# EAGLE design revb (EAGLE 9.6.2)

## Sheet 1 of 2
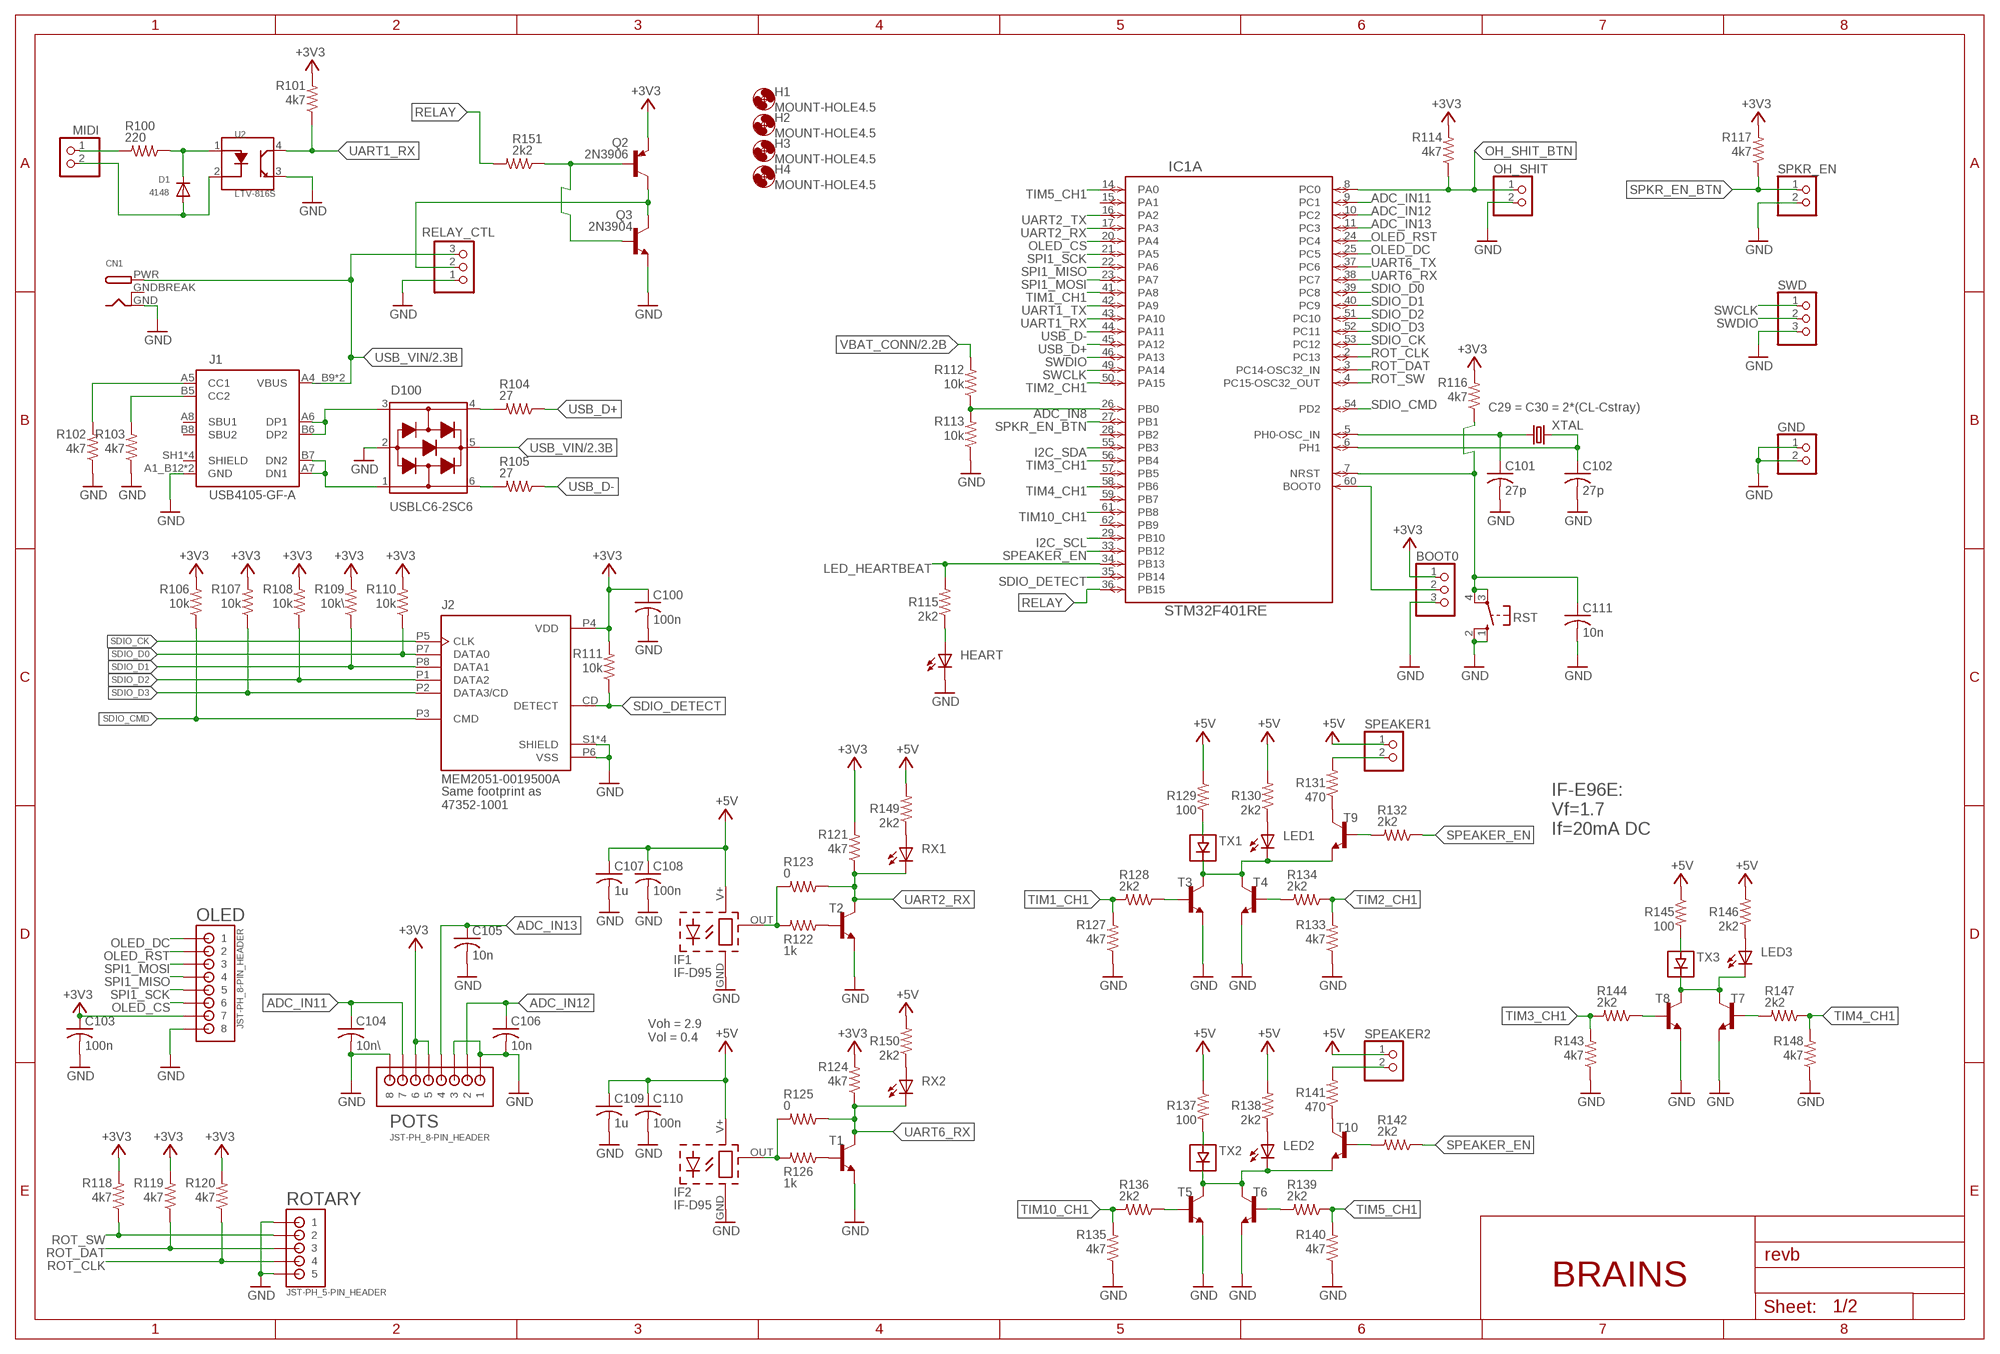
[diagram p0: schematic, sheet 1]

### Parts
BOOT0  PINHD-1X3  [1X03]
C100  100n  C-USC0603K  [C0603K]
C101  27p  C-USC0402  [C0402]
C102  27p  C-USC0402  [C0402]
C103  100n  C-USC0603K  [C0603K]
C104  10n\  C-USC0603K  [C0603K]
C105  10n  C-USC0603K  [C0603K]
C106  10n  C-USC0603K  [C0603K]
C107  1u  C-USC0603K  [C0603K]
C108  100n  C-USC0603K  [C0603K]
C109  1u  C-USC0603K  [C0603K]
C110  100n  C-USC0603K  [C0603K]
C111  10n  C-USC0603K  [C0603K]
CN1  DCBARRELPTH  [DCJACK_2MM_PTH]
D1  4148  DIODESOD-123  [SOD-123]
D100  USBLC6-2SC6  [SOT95P280X145-6N]
GND  PINHD-1X2  [1X02]
H1  MOUNT-HOLE4.5  [4,5]
H2  MOUNT-HOLE4.5  [4,5]
H3  MOUNT-HOLE4.5  [4,5]
H4  MOUNT-HOLE4.5  [4,5]
HEART  LEDCHIPLED_0805  [CHIPLED_0805]
IC1  STM32F401RE  STM32F401RET6  [LQFP64-10X10MM]
IF1  IF-D95  [IFD95]
IF2  IF-D95  [IFD95]
J1  USB4105-GF-A  [GCT_USB4105-GF-A]
J2  MEM2051-0019500A  MEM2051-00-195-00-A_REVD1MEM2051-00-195-00-A_GCT_MEM2051-00-195-00-A  [GCT_MEM2051-00-195-00-A_REVD1]
LED1  LEDCHIPLED_0805  [CHIPLED_0805]
LED2  LEDCHIPLED_0805  [CHIPLED_0805]
LED3  LEDCHIPLED_0805  [CHIPLED_0805]
MIDI  PINHD-1X2  [1X02]
OH_SHIT  PINHD-1X2  [1X02]
OLED  JST-PH_8-PIN_HEADER  [JST_B8B-PH_HEADER]
POTS  JST-PH_8-PIN_HEADER  [JST_B8B-PH_HEADER]
Q2  2N3906  [TO92]
Q3  2N3904  [TO92]
R100  220  R-US_R0603  [R0603]
R101  4k7  R-US_R0603  [R0603]
R102  4k7  R-US_R0603  [R0603]
R103  4k7  R-US_R0603  [R0603]
R104  27  R-US_R0603  [R0603]
R105  27  R-US_R0603  [R0603]
R106  10k  R-US_R0805  [R0805]
R107  10k  R-US_R0805  [R0805]
R108  10k  R-US_R0805  [R0805]
R109  10k\  R-US_R0805  [R0805]
R110  10k  R-US_R0805  [R0805]
R111  10k  R-US_R0805  [R0805]
R112  10k  R-US_R0805  [R0805]
R113  10k  R-US_R0805  [R0805]
R114  4k7  R-US_R0603  [R0603]
R115  2k2  R-US_R0603  [R0603]
R116  4k7  R-US_R0603  [R0603]
R117  4k7  R-US_R0603  [R0603]
R118  4k7  R-US_R0603  [R0603]
R119  4k7  R-US_R0603  [R0603]
R120  4k7  R-US_R0603  [R0603]
R121  4k7  R-US_R0603  [R0603]
R122  1k  R-US_R0805  [R0805]
R123  0  R-US_R0603  [R0603]
R124  4k7  R-US_R0603  [R0603]
R125  0  R-US_R0603  [R0603]
R126  1k  R-US_R0805  [R0805]
R127  4k7  R-US_R0603  [R0603]
R128  2k2  R-US_R0603  [R0603]
R129  100  R-US_R0805  [R0805]
R130  2k2  R-US_R0603  [R0603]
R131  470  R-US_R0603  [R0603]
R132  2k2  R-US_R0603  [R0603]
R133  4k7  R-US_R0603  [R0603]
R134  2k2  R-US_R0603  [R0603]
R135  4k7  R-US_R0603  [R0603]
R136  2k2  R-US_R0603  [R0603]
R137  100  R-US_R0805  [R0805]
R138  2k2  R-US_R0603  [R0603]
R139  2k2  R-US_R0603  [R0603]
R140  4k7  R-US_R0603  [R0603]
R141  470  R-US_R0603  [R0603]
R142  2k2  R-US_R0603  [R0603]
R143  4k7  R-US_R0603  [R0603]
R144  2k2  R-US_R0603  [R0603]
R145  100  R-US_R0805  [R0805]
R146  2k2  R-US_R0603  [R0603]
R147  2k2  R-US_R0603  [R0603]
R148  4k7  R-US_R0603  [R0603]
R149  2k2  R-US_R0603  [R0603]
R150  2k2  R-US_R0603  [R0603]
R151  2k2  R-US_R0603  [R0603]
RELAY_CTL  PINHD-1X3  [1X03]
ROTARY  JST-PH_5-PIN_HEADER  [JST_B5B-PH_HEADER]
RST  10-XX  [B3F-10XX]
RX1  LEDCHIPLED_0805  [CHIPLED_0805]
RX2  LEDCHIPLED_0805  [CHIPLED_0805]
SPEAKER1  PINHD-1X2  [1X02]
SPEAKER2  PINHD-1X2  [1X02]
SPKR_EN  PINHD-1X2  [1X02]
SWD  PINHD-1X3  [1X03]
T1  MMBTA06-7-F  BCV72SMD  [SOT23-BEC]
T2  MMBTA06-7-F  BCV72SMD  [SOT23-BEC]
T3  MMBTA06-7-F  BCV72SMD  [SOT23-BEC]
T4  MMBTA06-7-F  BCV72SMD  [SOT23-BEC]
T5  MMBTA06-7-F  BCV72SMD  [SOT23-BEC]
T6  MMBTA06-7-F  BCV72SMD  [SOT23-BEC]
T7  MMBTA06-7-F  BCV72SMD  [SOT23-BEC]
T8  MMBTA06-7-F  BCV72SMD  [SOT23-BEC]
T9  MMBTA06-7-F  BCV72SMD  [SOT23-BEC]
T10  MMBTA06-7-F  BCV72SMD  [SOT23-BEC]
TX1  IF-E95E  [IF-E96E]
TX2  IF-E95E  [IF-E96E]
TX3  IF-E95E  [IF-E96E]
U2  LTV-816S  SMD-PHOTOCOUPLER-5KV-LTV-816S(4P-4.6X6.5MM)  [SMD4-2.54-4.6X6.5MM]
XTAL  CRYSTALHC49S  [HC49/S]

### Nets
+3V3: BOOT0.1 C100.1 C103.1 J2.P4(VDD) OLED.P7 POTS.P5 POTS.P6 Q2.3(E) R101.2 R106.2 R107.2 R108.2 R109.2 R110.2 R111.2 R114.2 R116.2 R117.2 R118.2 R119.2 R120.2 R121.2 R124.2 ; also sheet 2
+5V: C107.1 C108.1 C109.1 C110.1 IF1.V+(VCC) IF2.V+(VCC) R129.1 R130.2 R137.1 R138.2 R145.1 R146.2 R149.2 R150.2 SPEAKER1.1 SPEAKER2.1 ; also sheet 2
ADC_IN8: IC1.26(A:PB0) R112.1 R113.2
ADC_IN11: C104.1 IC1.9(A:PC1) POTS.P7
ADC_IN12: C106.1 IC1.10(A:PC2) POTS.P2
ADC_IN13: C105.1 IC1.11(A:PC3) POTS.P4
BOOT0_CONN: BOOT0.2 IC1.60(A:BOOT0)
CC1: J1.A5(CC1) R102.2
CC2: J1.B5(CC2) R103.2
COIL1_B: R128.1 T3.B
COIL1_NEG: LED1.C T3.C T4.C T9.E TX1.GND
COIL1_POS: R129.2 TX1.SIG
COIL2_B: R136.1 T5.B
COIL2_NEG: LED2.C T5.C T6.C T10.E TX2.GND
COIL2_POS: R137.2 TX2.SIG
COIL3_B: R144.1 T8.B
COIL3_NEG: LED3.C T7.C T8.C TX3.GND
COIL3_POS: R145.2 TX3.SIG
COIL12_B: R134.2 T4.B
COIL22_B: R139.2 T6.B
COIL32_B: R147.2 T7.B
GND: BOOT0.3 C100.2 C101.2 C102.2 C103.2 C104.2 C105.2 C106.2 C107.2 C108.2 C109.2 C110.2 C111.2 CN1.GND D100.2(GND) GND.1 GND.2 HEART.C IF1.GND IF2.GND J1.A1_B12(GND) J1.B1_A12(GND) J2.P6(VSS) J2.S1(SHIELD) J2.S2(SHIELD) J2.S3(SHIELD) J2.S4(SHIELD) OH_SHIT.2 OLED.P8 POTS.P1 POTS.P3 POTS.P8 Q3.3(E) R102.1 R103.1 R113.1 R127.1 R133.1 R135.1 R140.1 R143.1 R148.1 RELAY_CTL.1 ROTARY.P1 ROTARY.P5 RST.1(S) RST.2(S1) SPKR_EN.2 SWD.3 T1.E T2.E T3.E T4.E T5.E T6.E T7.E T8.E U2.3(EMITER) ; also sheet 2
I2C_SCL: IC1.29(A:PB10) ; also sheet 2
I2C_SDA: IC1.55(A:PB3) ; also sheet 2
IF1-OUT: IF1.OUT R122.2 R123.2
IF2-OUT: IF2.OUT R125.2 R126.2
LED_HEARTBEAT: IC1.34(A:PB13) R115.2
LTV+: D1.C R100.1 U2.1(ANODE)
LTV-: D1.A MIDI.2 U2.2(CATHODE)
MID_RX_IN: MIDI.1 R100.2
N$2: LED1.A R130.1
N$3: R122.1 T2.B
N$4: LED3.A R146.1
N$5: LED2.A R138.1
N$7: R149.1 RX1.A
N$8: R150.1 RX2.A
N$9: R126.1 T1.B
N$10: R131.1 T9.C
N$21: R141.1 T10.C
NRST: C111.1 IC1.7(A:NRST) R116.1 RST.3(P) RST.4(P1)
OH_SHIT_BTN: IC1.8(A:PC0) OH_SHIT.1 R114.1
OLED_CS: IC1.20(A:PA4) OLED.P6
OLED_DC: IC1.25(A:PC5) OLED.P1
OLED_RST: IC1.24(A:PC4) OLED.P2
R-HB: HEART.A R115.1
RELAY: IC1.36(A:PB15) R151.2
RELAY_OUT: Q2.1(C) Q3.1(C) RELAY_CTL.2
RLY_BASE: Q2.2(B) Q3.2(B) R151.1
ROT_CLK: IC1.2(A:PC13) R120.1 ROTARY.P4
ROT_DAT: IC1.3(A:PC14-OSC32_IN) R119.1 ROTARY.P3
ROT_SW: IC1.4(A:PC15-OSC32_OUT) R118.1 ROTARY.P2
SDIO_CK: IC1.53(A:PC12) J2.P5(CLK)
SDIO_CMD: IC1.54(A:PD2) J2.P3(CMD) R106.1
SDIO_D0: IC1.39(A:PC8) J2.P7(DATA0) R110.1
SDIO_D1: IC1.40(A:PC9) J2.P8(DATA1) R109.1
SDIO_D2: IC1.51(A:PC10) J2.P1(DATA2) R108.1
SDIO_D3: IC1.52(A:PC11) J2.P2(DATA3/CD) R107.1
SDIO_DETECT: IC1.35(A:PB14) J2.CD(DETECT) R111.1
SPEAK1-R: R131.2 SPEAKER1.2
SPEAKER_EN: IC1.33(A:PB12) R132.1 R142.1
SPI1_MISO: IC1.22(A:PA6) OLED.P4
SPI1_MOSI: IC1.23(A:PA7) OLED.P3
SPI1_SCK: IC1.21(A:PA5) OLED.P5
SPK2_R: R141.2 SPEAKER2.2
SPK_EN1_B: R132.2 T9.B
SPK_EN2_B: R142.2 T10.B
SPKR_EN_BTN: IC1.27(A:PB1) R117.1 SPKR_EN.1
SWCLK: IC1.49(A:PA14) SWD.1
SWDIO: IC1.46(A:PA13) SWD.2
TIM1_CH1: IC1.41(A:PA8) R127.2 R128.2
TIM2_CH1: IC1.50(A:PA15) R133.2 R134.1
TIM3_CH1: IC1.56(A:PB4) R143.2 R144.2
TIM4_CH1: IC1.58(A:PB6) R147.1 R148.2
TIM5_CH1: IC1.14(A:PA0) R139.1 R140.2
TIM10_CH1: IC1.61(A:PB8) R135.2 R136.2
UART1_RX: IC1.43(A:PA10) R101.1 U2.4(COLLECTOR)
UART1_TX: IC1.42(A:PA9)
UART2_RX: IC1.17(A:PA3) R121.1 R123.1 RX1.C T2.C
UART2_TX: IC1.16(A:PA2)
UART6_RX: IC1.38(A:PC7) R124.1 R125.1 RX2.C T1.C
UART6_TX: IC1.37(A:PC6)
USB_D+: IC1.45(A:PA12) R104.1
USB_D-: IC1.44(A:PA11) R105.1
USB_VIN: CN1.PWR D100.5(VBUS) J1.A4_B9(VBUS) J1.B4_A9(VBUS) RELAY_CTL.3 ; also sheet 2
USBDN_CONN: D100.1(I/O1_IN) J1.A7(DN1) J1.B7(DN2)
USBDP_CONN: D100.3(I/O2_IN) J1.A6(DP1) J1.B6(DP2)
USBRESD_N: D100.6(I/O1_OUT) R105.2
USBRESD_P: D100.4(I/O2_OUT) R104.2
VBAT_CONN: R112.2 ; also sheet 2
XTAL1: C101.1 IC1.5(A:PH0-OSC_IN) XTAL.1
XTAL2: C102.1 IC1.6(A:PH1) XTAL.2
Unconnected: IC1.15(A:PA1) IC1.28(A:PB2) IC1.57(A:PB5) IC1.59(A:PB7) IC1.62(A:PB9) J1.A8(SBU1) J1.B8(SBU2)

### Notes on the sheet
- C29 = C30 = 2*(CL-Cstray)
- Same footprint as 
  47352-1001
- IF-E96E:
  Vf=1.7
  If=20mA DC
- Voh = 2.9
  Vol = 0.4
- BRAINS

## Sheet 2 of 2
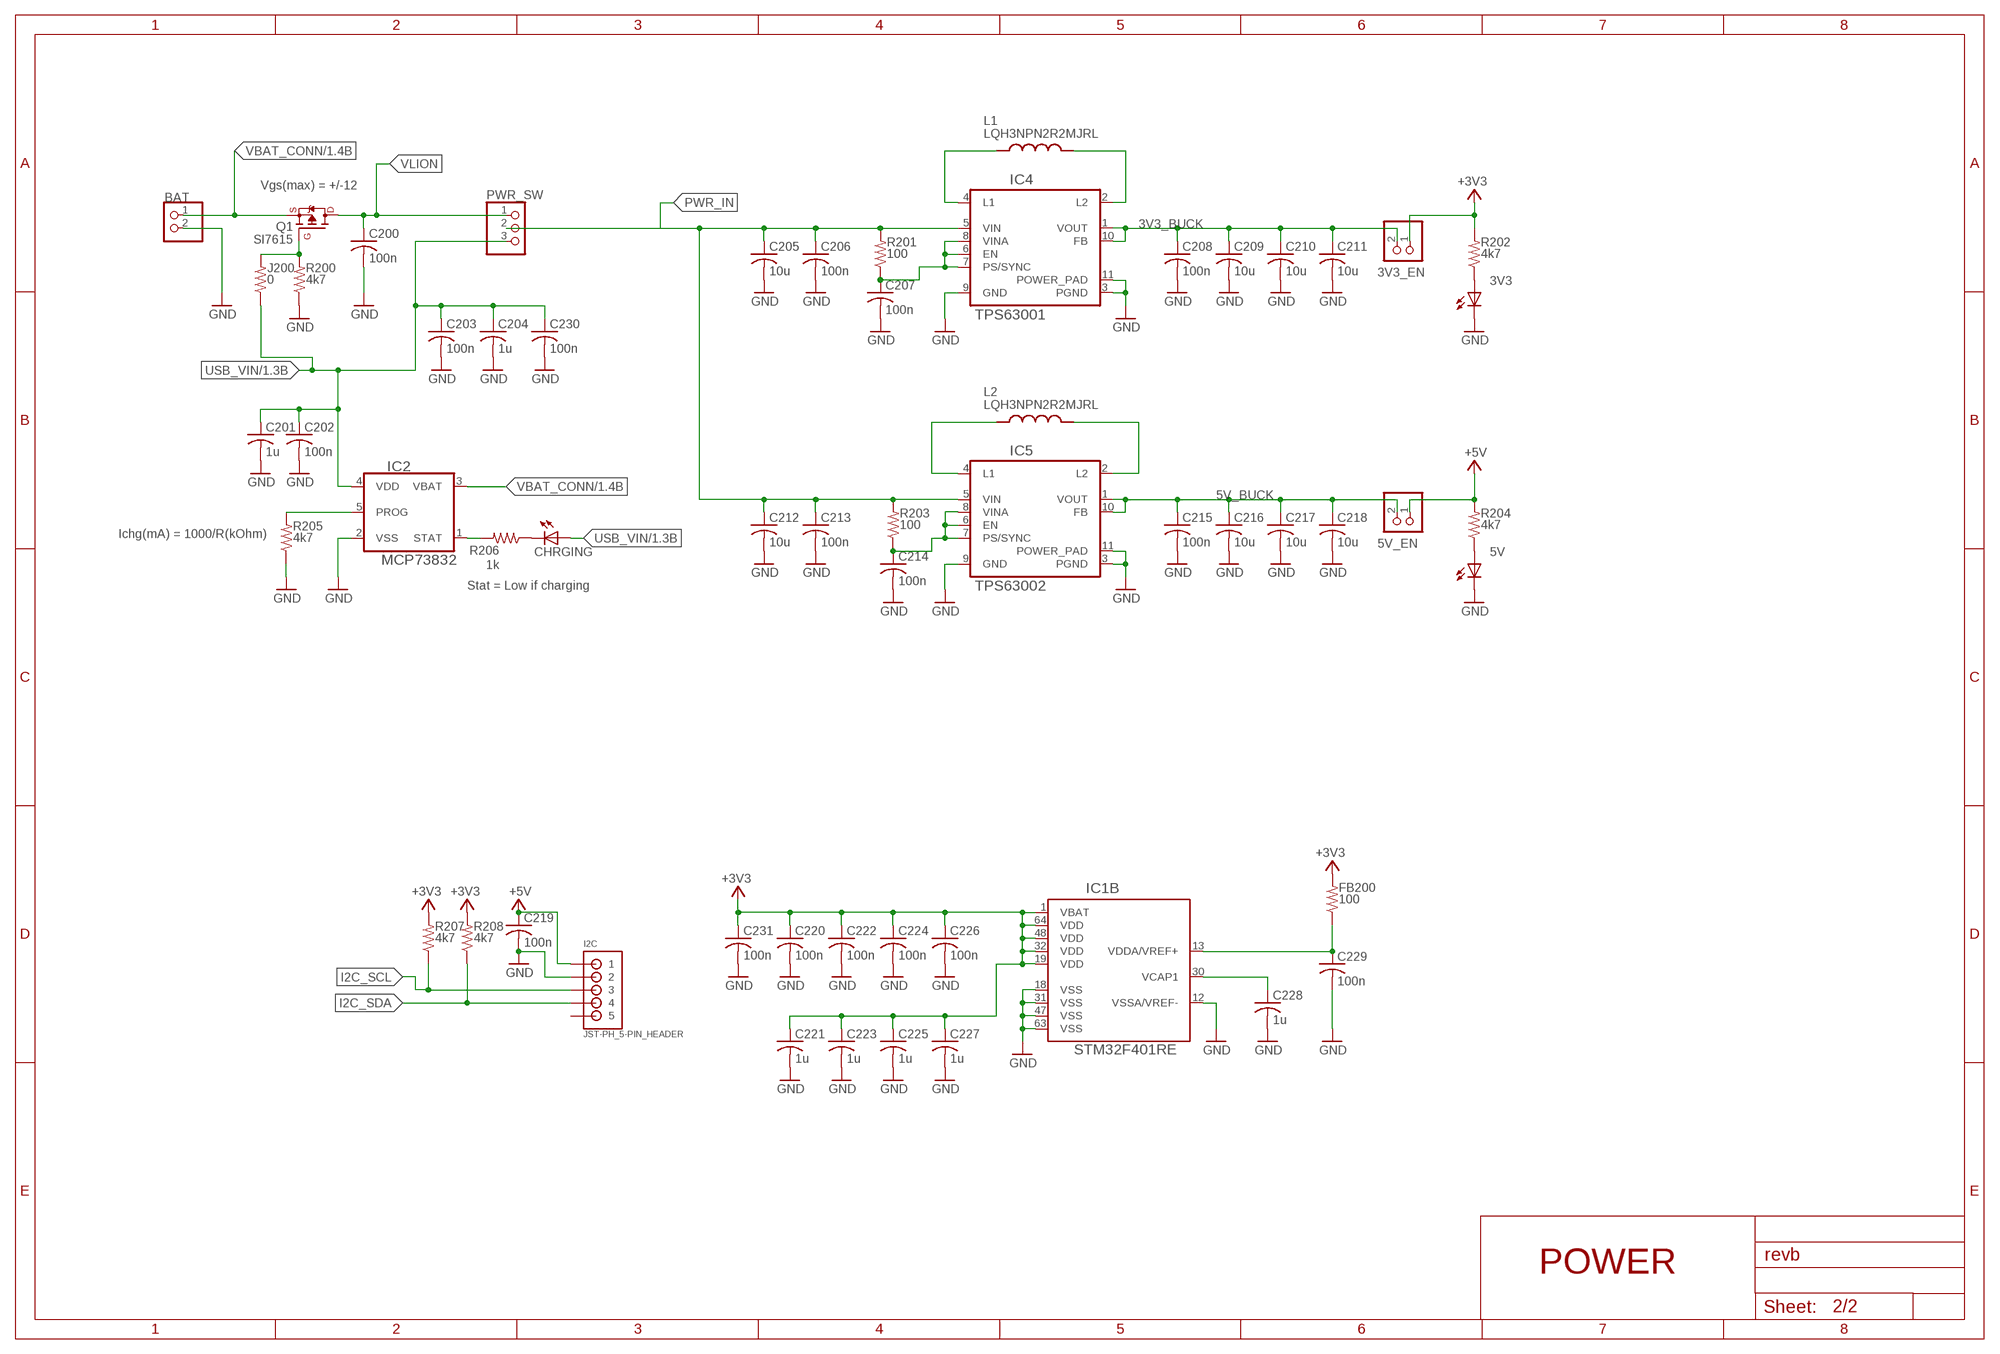
[diagram p1: schematic, sheet 2]

### Parts
3V3  LEDCHIPLED_0603  [CHIPLED_0603]
3V3_EN  PINHD-1X2  [1X02]
5V  LEDCHIPLED_0603  [CHIPLED_0603]
5V_EN  PINHD-1X2  [1X02]
BAT  JST_2PIN-THM  [JST-PH-2-THM]
C200  100n  C-USC0603K  [C0603K]
C201  1u  C-USC0603K  [C0603K]
C202  100n  C-USC0603K  [C0603K]
C203  100n  C-USC0603K  [C0603K]
C204  1u  C-USC0603K  [C0603K]
C205  10u  C-USC0805  [C0805]
C206  100n  C-USC0603K  [C0603K]
C207  100n  C-USC0603K  [C0603K]
C208  100n  C-USC0603K  [C0603K]
C209  10u  C-USC0805  [C0805]
C210  10u  C-USC0805  [C0805]
C211  10u  C-USC0805  [C0805]
C212  10u  C-USC0805  [C0805]
C213  100n  C-USC0603K  [C0603K]
C214  100n  C-USC0603K  [C0603K]
C215  100n  C-USC0603K  [C0603K]
C216  10u  C-USC0805  [C0805]
C217  10u  C-USC0805  [C0805]
C218  10u  C-USC0805  [C0805]
C219  100n  C-USC0603K  [C0603K]
C220  100n  C-USC0603K  [C0603K]
C221  1u  C-USC0603K  [C0603K]
C222  100n  C-USC0603K  [C0603K]
C223  1u  C-USC0603K  [C0603K]
C224  100n  C-USC0603K  [C0603K]
C225  1u  C-USC0603K  [C0603K]
C226  100n  C-USC0603K  [C0603K]
C227  1u  C-USC0603K  [C0603K]
C228  1u  C-USC0603K  [C0603K]
C229  100n  C-USC0603K  [C0603K]
C230  100n  C-USC0603K  [C0603K]
C231  100n  C-USC0603K  [C0603K]
CHRGING  LEDCHIPLED_1206  [CHIPLED_1206]
FB200  100  R-US_R0603  [R0603]
I2C  JST-PH_5-PIN_HEADER  [JST_B5B-PH_HEADER]
IC2  MCP73832  MCP73831T-2ACI/OT  [SOT95P280X145-5N]
IC4  TPS63001  TPS63001DRCR  [VREG_V62/16624-01YE]
IC5  TPS63002  TPS63001DRCR  [VREG_V62/16624-01YE]
J200  0  R-US_R0402  [R0402]
L1  LQH3NPN2R2MJRL  [IND_LQH3NPN2R2MJRL]
L2  LQH3NPN2R2MJRL  [IND_LQH3NPN2R2MJRL]
PWR_SW  PINHD-1X3  [1X03]
Q1  SI7615  SI7611DN-T1-GE3  [VISHAY_SIS468DN-T1-GE3]
R200  4k7  R-US_R0603  [R0603]
R201  100  R-US_R0603  [R0603]
R202  4k7  R-US_R0603  [R0603]
R203  100  R-US_R0603  [R0603]
R204  4k7  R-US_R0603  [R0603]
R205  4k7  R-US_R0603  [R0603]
R206  1k  R-US_R0603  [R0603]
R207  4k7  R-US_R0603  [R0603]
R208  4k7  R-US_R0603  [R0603]

### Nets
3V3_BUCK: 3V3_EN.2 C208.1 C209.1 C210.1 C211.1 IC4.1(VOUT) IC4.10(FB)
5V_BUCK: 5V_EN.2 C215.1 C216.1 C217.1 C218.1 IC5.1(VOUT) IC5.10(FB)
+3V3: 3V3_EN.1 C220.1 C221.1 C222.1 C223.1 C224.1 C225.1 C226.1 C227.1 C231.1 FB200.2 IC1.1(B:VBAT) IC1.19(B:VDD) IC1.32(B:VDD) IC1.48(B:VDD) IC1.64(B:VDD) R202.2 R207.2 R208.2 ; also sheet 1
+5V: 5V_EN.1 C219.1 I2C.P1 R204.2 ; also sheet 1
BUCK33_LOGIC: C207.1 IC4.6(EN) IC4.7(PS/SYNC) IC4.8(VINA) R201.1
BUCK50_LOGIC: C214.1 IC5.6(EN) IC5.7(PS/SYNC) IC5.8(VINA) R203.1
CHG_PROG: IC2.5(PROG) R205.2
CHRG_STAT: IC2.1(STAT) R206.2
GND: 3V3.C 5V.C BAT.2 C200.2 C201.2 C202.2 C203.2 C204.2 C205.2 C206.2 C207.2 C208.2 C209.2 C210.2 C211.2 C212.2 C213.2 C214.2 C215.2 C216.2 C217.2 C218.2 C219.2 C220.2 C221.2 C222.2 C223.2 C224.2 C225.2 C226.2 C227.2 C228.2 C229.2 C230.2 C231.2 I2C.P2 IC1.12(B:VSSA/VREF-) IC1.18(B:VSS) IC1.31(B:VSS) IC1.47(B:VSS) IC1.63(B:VSS) IC2.2(VSS) IC4.3(PGND) IC4.9(GND) IC4.11(POWER_PAD) IC5.3(PGND) IC5.9(GND) IC5.11(POWER_PAD) R200.1 R205.1 ; also sheet 1
I2C_SCL: I2C.P3 R207.1 ; also sheet 1
I2C_SDA: I2C.P4 R208.1 ; also sheet 1
IC4L1: IC4.4(L1) L1.1
IC4L2: IC4.2(L2) L1.2
IC5L1: IC5.4(L1) L2.1
IC5L2: IC5.2(L2) L2.2
N$1: 3V3.A R202.1
N$6: 5V.A R204.1
N$17: CHRGING.C R206.1
PMOS_G: J200.2 Q1.4(G) R200.2
PWR_IN: C205.1 C206.1 C212.1 C213.1 IC4.5(VIN) IC5.5(VIN) PWR_SW.2 R201.2 R203.2
USB_VIN: C201.1 C202.1 C203.1 C204.1 C230.1 CHRGING.A IC2.4(VDD) J200.1 PWR_SW.3 ; also sheet 1
VBAT_CONN: BAT.1 IC2.3(VBAT) Q1.1(S) Q1.2(S) Q1.3(S) ; also sheet 1
VCAP1: C228.1 IC1.30(B:VCAP1)
VLION: C200.1 PWR_SW.1 Q1.5(D) Q1.6(D) Q1.7(D) Q1.8(D) Q1.9(D)
VREF+: C229.1 FB200.1 IC1.13(B:VDDA/VREF+)
Unconnected: I2C.P5

### Notes on the sheet
- Vgs(max) = +/-12
- Ichg(mA) = 1000/R(kOhm)
- Stat = Low if charging
- POWER

## Power pins joined to a net without a drawn wire
GNDBREAK: CN1.GNDBREAK
SHIELD: J1.SH1(SHIELD) J1.SH2(SHIELD) J1.SH3(SHIELD) J1.SH4(SHIELD)

## Library data of the parts
3V3 5V CHRGING HEART LED1-LED3 RX1 RX2 = adafruit:LED: LED OSRAM: - CHIPLED LG R971, LG N971, LY N971, LG Q971, LY Q971, LO R971, LY R971 LH N974, LH R974 LS Q976, LO Q976, LY Q976 LO Q996 - Hyper CHIPLED LW Q18S LB Q993, LB Q99A, LB R99A - SideLED LS A670, LO A670, LY A670, LG A670, LP A670 LB A673, LV A673, LT A673, LW A673 LH A674 LY A675 LS A676, LA A676, LO A676, LY A676, LW A676 LS A679, LY A679, LG A679 - Hyper Micro SIDELED® LS Y876, LA Y876, LO Y876, LY Y876 LT Y87S - SmartLED LW L88C, LW L88S LB L89C, LB L89S, LG L890 LS L89K, LO L89K, LY L89K LS L896, LA L896, LO L896, LY L896 - TOPLED LS T670, LO T670, LY T670, LG T670, LP T670 LSG T670, LSP T670, LSY T670, LOP T670, LYG T670 LG T671, LOG T671, LSG T671 LB T673, LV T673, LT T673, LW T673 LH T674 LS T676, LA T676, LO T676, LY T676, LB T676, LH T676, LSB T676, LW T676 LB T67C, LV T67C, LT T67C, LS T67K, LO T67K, LY T67K, LW E67C LS E67B, LA E67B, LO E67B, LY E67B, LB E67C, LV E67C, LT E67C LW T67C LS T679, LY T679, LG T679 LS T770, LO T770, LY T770, LG T770, LP T770 LB T773, LV T773, LT T773, LW T773 LH T774 LS E675, LA E675, LY E675, LS T675 LS T776, LA T776, LO T776, LY T776, LB T776 LHGB T686 LT T68C, LB T68C - Hyper Mini TOPLED® LB M676 - Mini TOPLED Santana® LG M470 LS M47K, LO M47K, LY M47K Source: http://www.osram.convergy.de/
3V3_EN 5V_EN GND MIDI OH_SHIT SPEAKER1 SPEAKER2 SPKR_EN = pinhead:PINHD-1X2: PIN HEADER
BAT = adafruit:JST_2PIN: JST 2-Pin Connectors of various flavors SMT-RA (S2B-PH-SM4) 4UConnector #17311 SMT (B2B-PH-SM4) THM-RA (S2B-PH) THM (B2B-PH)
BOOT0 = pinhead:PINHD-1X3: PIN HEADER
C100-C111 C200-C231 = adafruit:C-US: CAPACITOR, American symbol
CN1 = adafruit:DCBARREL: 2.0mm DC Barrel Jack DCJACK_2MM_PTH - Through Hole Jack (4UConnector: 05537)
D1 = adafruit:DIODE: Diode SMADIODE - SMA Surface Mount Package 20V 1A Schottky Diode Digikey: 641-1014-6-ND DO-1N4148 - Through Hole Small Current Diode SOD-123 20V 1 A (.5mV Vf) Schottky Diode - Digikey: MBRX120TPMSCT-ND SOD-323 10V 570mA (.38mV Vf, 3ns) Schottky Diode - Digikey: ZLLS410CT-ND SOD-523 30V 30mA Schottky Diode (RB751S-40TE61) - Digikey: RB751S-40TE61CT-ND SOT23-R/W - SOT23 Package (R = Solder Paste/Reflow Ovens, W = Hand-Soldering) BAT54Film 40V 300mA - Digikey: 497-7162-1-ND
D100 = USBLC6-2SC6:USBLC6-2SC6: Check availability <https://pricing.snapeda.com/parts/USBLC6-2SC6/STMicroelectronics/view-part?ref=eda> Check availability <https://pricing.snapeda.com/parts/USBLC6-2SC6/STMicroelectronics/view-part?ref=eda>; AVAILABILITY: In Stock; DESCRIPTION: 17V Clamp 5A (8/20µs) Ipp Tvs Diode Surface Mount SOT-23-6; MF: STMicroelectronics; MP: USBLC6-2SC6; PACKAGE: SOT-23-6 STMicroelectronics; PRICE: None; PURCHASE-URL: https://pricing.snapeda.com/search/part/USBLC6-2SC6/?ref=eda
FB200 J200 R100-R151 R200-R208 = rcl:R-US_: RESISTOR, American symbol; SPICEPREFIX: R
H1-H4 = holes:MOUNT-HOLE: MOUNTING HOLE with drill center marker
I2C ROTARY = SRG:JST-PH_5-PIN_HEADER: 5-pin JST PH Shrouded Header, top entry P/N B5B-PH-K-S Mating connector PHR-5 Mating cable assembly: Sparkfun PRT-09917 <http://www.sparkfun.com/products/9917>
IC1 = F401RE_interrupter:STM32F401RET6; COPYRIGHT: Copyright (C) 2024 Ultra Librarian. All rights reserved.; MANUFACTURER_PART_NUMBER: STM32F401RET6; MFR_NAME: STMicroelectronics
IC2 = MCP73831T-2ACI_OT:MCP73831T-2ACI/OT: Charge Management Controller; MPN: MCP73831T-2ACI/OT; OC_FARNELL: 1332158; OC_NEWARK: 56K7045; PACKAGE: SOT-5; SUPPLIER: Microchip
IC4 IC5 = TPS63001DRCR:TPS63001DRCR
IF1 IF2 = onecoil:IF-D95
J1 = USB4105-GF-A:USB4105-GF-A; MANUFACTURER: Global Connector Technology; MAXIMUM_PACKAGE_HEIGHT: 3.31mm; PARTREV: B3; STANDARD: Manufacturer Recommendations
J2 = MEM2051-00-195-00-A_REVD1:MEM2051-00-195-00-A_REVD1; MANUFACTURER: GCT; MAXIMUM_PACKAGE_HEIGHT: 2.05 mm; PARTREV: D1; SNAPEDA_PN: MEM2051-00-195-00-A; STANDARD: Manufacturer Recommendations
L1 L2 = LQH3NPN2R2MJRL:LQH3NPN2R2MJRL: Inductor Power Chip Shielded Wirewound 33uH 20% 1MHz Ferrite 0.63A 0.948Ohm DCR 1212 T/R; MANUFACTURER: Murata; MAXIMUM_PACKAGE_HEIGHT: 1.2mm; PARTREV: N/A; STANDARD: Manufacturer Recommendations
OLED POTS = SRG:JST-PH_8-PIN_HEADER
PWR_SW RELAY_CTL SWD = adafruit:PINHD-1X3: PIN HEADER
Q1 = SI7611DN-T1-GE3:SI7611DN-T1-GE3: P-Channel 40 V 0.025 Ohm 39 W Surface Mount Power Mosfet - PowerPAK-1212-8 Check availability <https://pricing.snapeda.com/parts/SI7611DN-T1-GE3/Vishay/view-part?ref=eda>; AVAILABILITY: In Stock; CHECK_PRICES: https://www.snapeda.com/parts/SI7611DN-T1-GE3/Vishay+Siliconix/view-part/?ref=eda; DESCRIPTION: MOSFET P-CH 40V 18A 1212-8 | Siliconix / Vishay SI7611DN-T1-GE3; MF: Vishay; MP: SI7611DN-T1-GE3; PACKAGE: PowerPAK®-1212 Vishay; PRICE: None; PURCHASE-URL: https://www.snapeda.com/api/url_track_click_mouser/?unipart_id=245086&manufacturer=Vishay&part_name=SI7611DN-T1-GE3&search_term=None; SNAPEDA_LINK: https://www.snapeda.com/parts/SI7611DN-T1-GE3/Vishay+Siliconix/view-part/?ref=snap
Q2 = transistor-pnp:2N3906: PNP Transistor
Q3 = transistor-neu-to92:2N3904: NPN TRANSISTOR
RST = switch-omron:10-XX: OMRON SWITCH; MPN: B3F-1000; OC_FARNELL: 176432; OC_NEWARK: 36M3542
T1-T10 = transistor-npn:BCV72*: NPN Transistor
TX1-TX3 = IF-E96E:IF-E95E
U2 = LTV-816S:SMD-PHOTOCOUPLER-5KV-LTV-816S(4P-4.6X6.5MM): 306060007; MPN: LTV-816S
XTAL = adafruit:CRYSTAL: CRYSTAL; OC_FARNELL: 1667008; OC_NEWARK: unknown

## Board
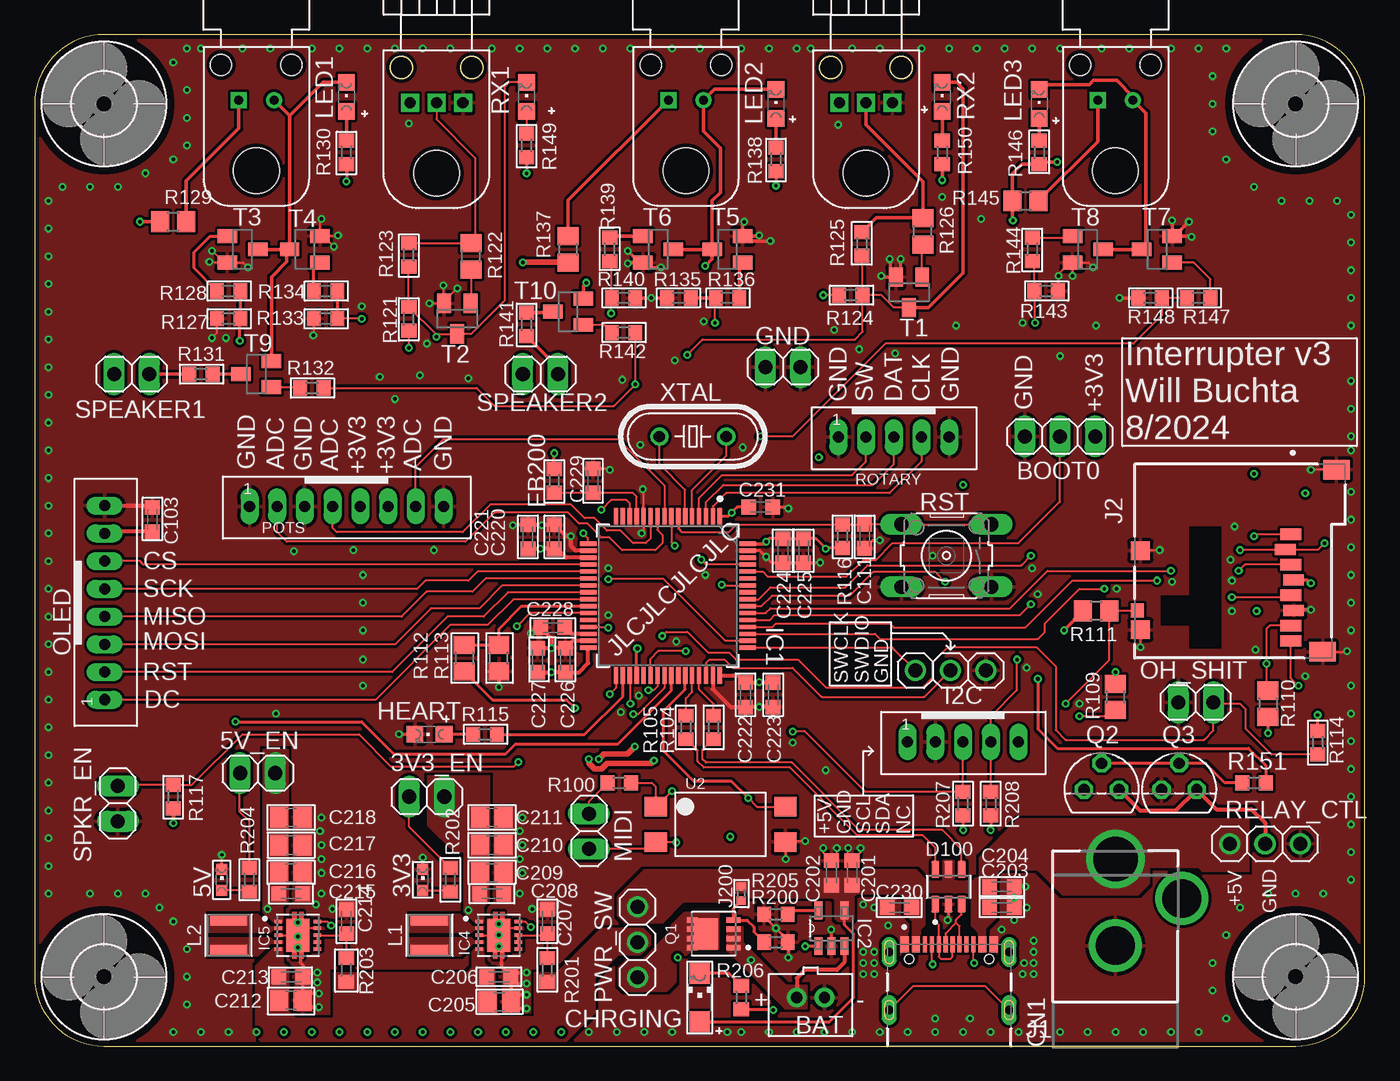
[diagram p2: board, top side]
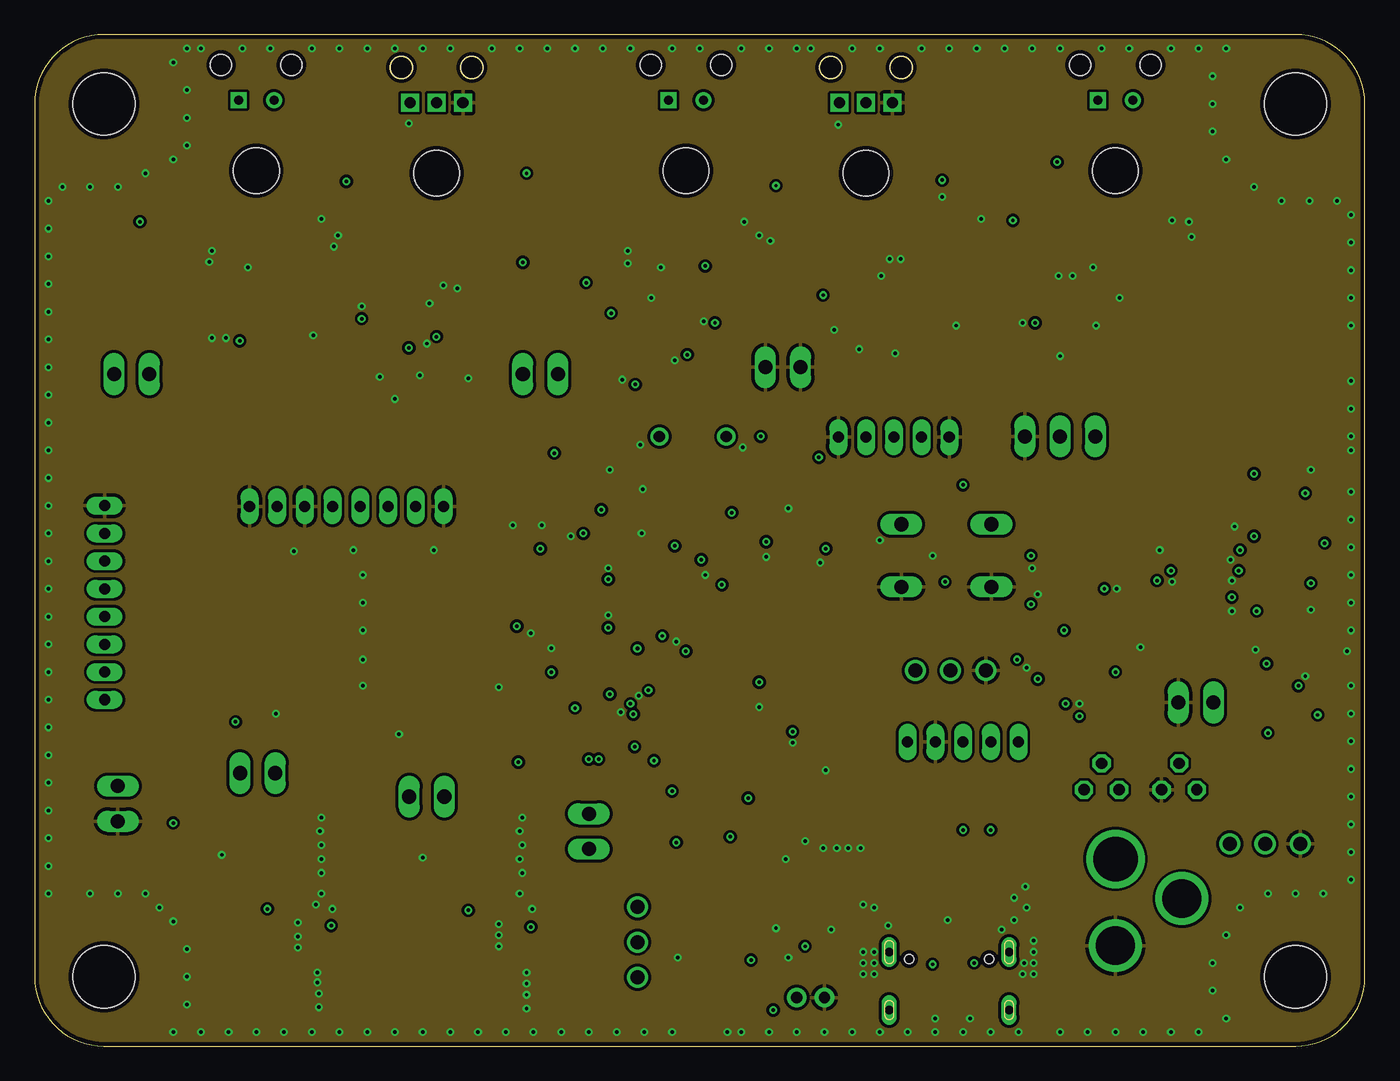
[diagram p3: board, inner layer Route2]
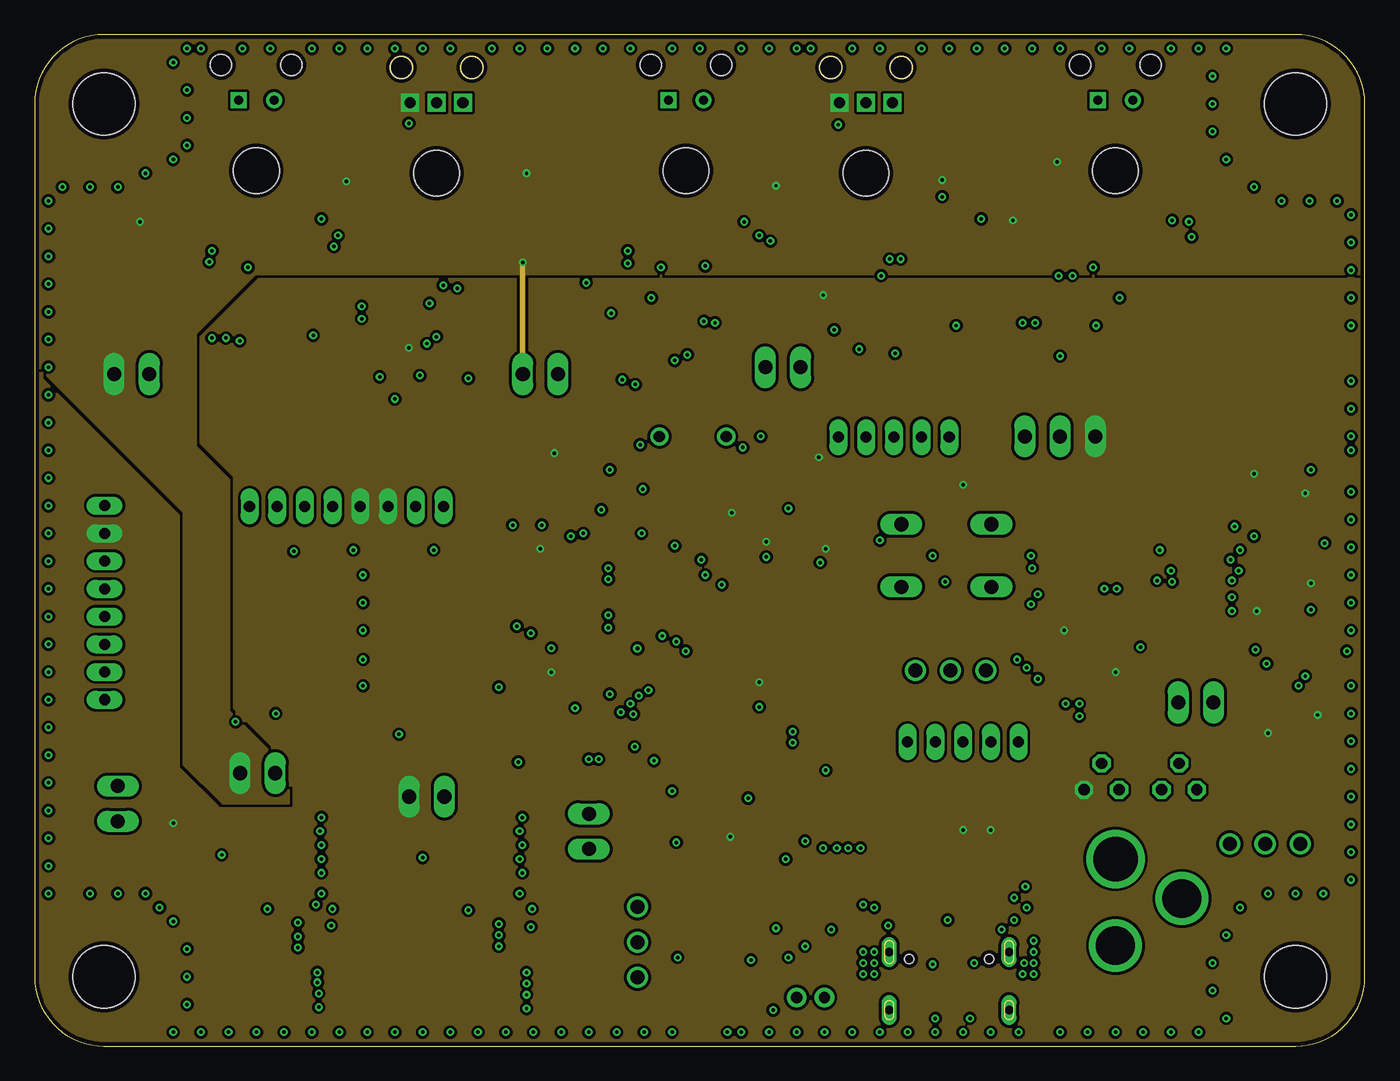
[diagram p4: board, inner layer Route15]
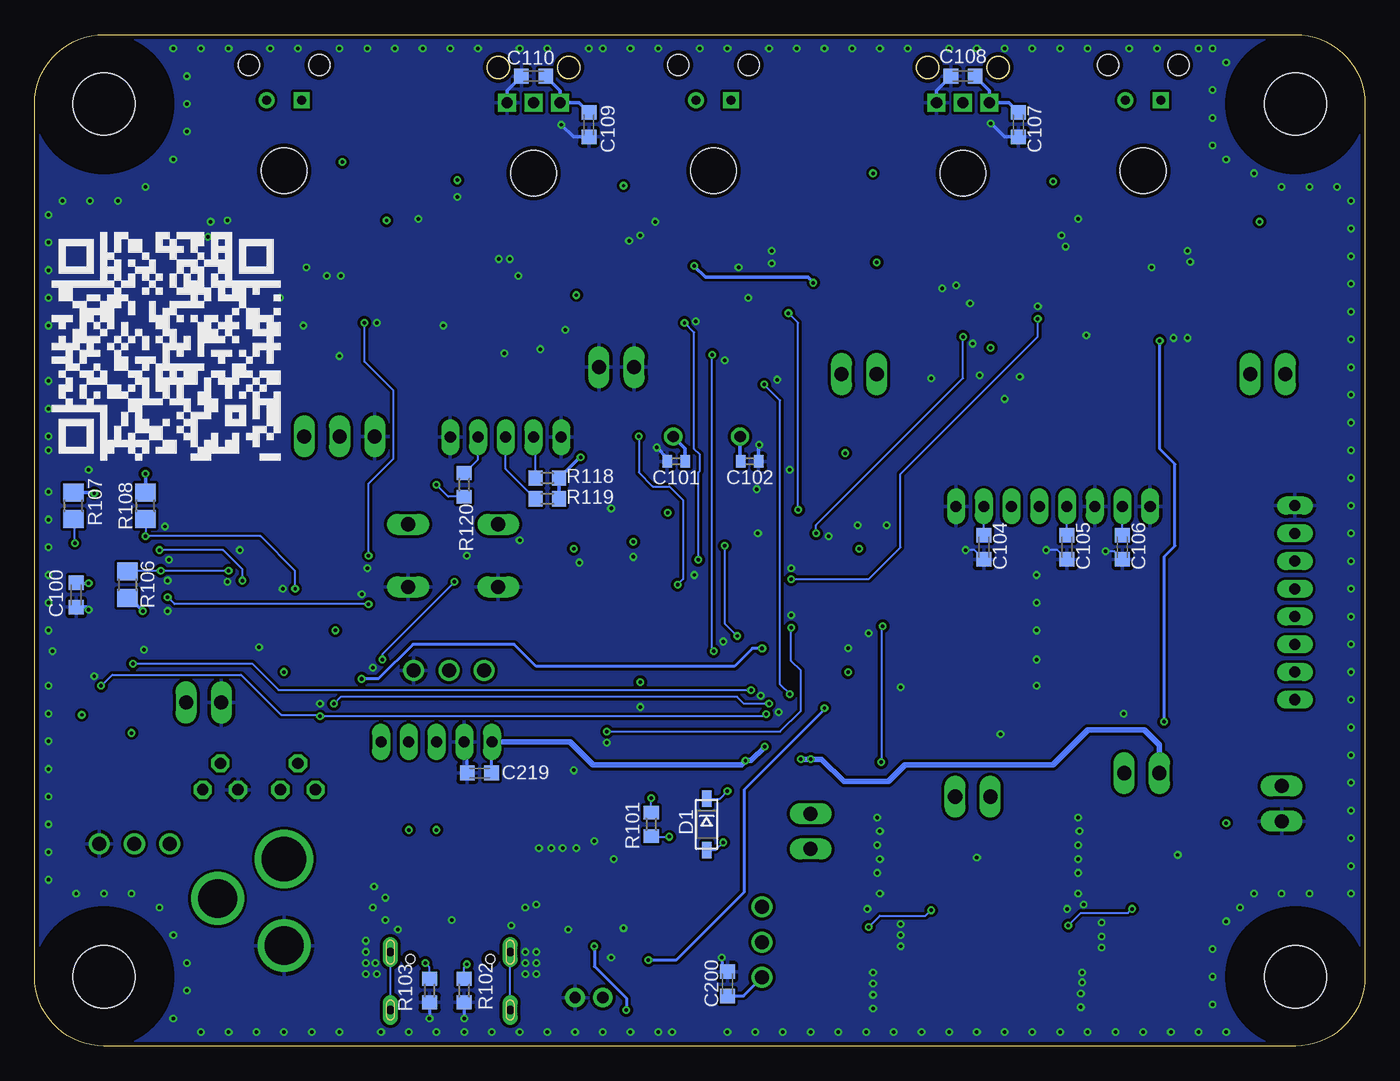
[diagram p5: board, bottom side, seen from below]

Size 96 x 73 mm. Coordinates in mm from the lower left corner, seen from the top.
Outline: 0,68 0,5 arc90 5,0 91,0 arc90 96,5 96,68 arc90 91,73 5,73 arc90 0,68
Copper layers (1+2*15+16): Top 0.035mm / dielectric 0.15mm / Route2 0.035mm / dielectric 0.15mm / Route15 0.035mm / dielectric 0.2mm / Bottom 0.035mm
Design rules "jlc-4 *": minimum track width 6mil, minimum drill 0.2mm, track to track 8mil, track to pad 7mil, pad to pad 7mil, via to via 8mil, smd to smd 6mil, copper to edge 0.3mm, drill to drill 0.4mm, minimum pad ring 0.25mm, minimum via ring 0.15mm, stop-mask expansion 4mil, vias tented up to drill 0mil, thermal gap 10mil

### Footprints (pad centres in the part's own frame; a part is rotated, then mirrored left to right if it is on the bottom)
CHIPLED_0603 = smd 0.8 x 0.8: A 0,-0.75; C 0,0.75
1X02 = drill 1.016 long: 1 -1.27,0; 2 1.27,0
JST-PH-2-THM = drill 0.8 pad 1.422: 1 1,0; 2 -1,0
1X03 = drill 1.016 long: 1 -2.54,0; 2 0,0; 3 2.54,0
C0603K = smd 1.05 x 1.08: 1 -0.875,0; 2 0.875,0
C0402 = smd 0.7 x 0.9: 1 -0.65,0; 2 0.65,0
C0805 = smd 1.3 x 1.5: 1 -0.85,0; 2 0.85,0
CHIPLED_1206 = smd 1.5 x 1.5: A 0,-1.75; C 0,1.75
DCJACK_2MM_PTH = drill 2.8: GND 0,7.35; GNDBREAK 4.8,10.75 | drill 3.2: PWR 0,13.6
SOD-123 = smd 1.2 x 0.7: A 1.85,0; C -1.85,0
SOT95P280X145-6N = smd 1.21 x 0.59: 1 -1.255,0.95; 2 -1.255,0; 3 -1.255,-0.95; 4 1.255,-0.95; 5 1.255,0; 6 1.255,0.95
R0603 = smd 1 x 1.1: 1 -0.85,0; 2 0.85,0
4,5 = hole 4.5: 0,0
CHIPLED_0805 = smd 1.2 x 1.2: A 0,-1.05; C 0,1.05
JST_B5B-PH_HEADER = drill 0.8 long: P1 4,0.048; P2 2,0.048; P3 0,0.048; P4 -2,0.048; P5 -4,0.048
LQFP64-10X10MM = smd 1.194 x 0.305: 1 -5.75,3.75; 2 -5.75,3.25; 3 -5.75,2.75; 4 -5.75,2.25; 5 -5.75,1.75; 6 -5.75,1.25; 7 -5.75,0.75; 8 -5.75,0.25; 9 -5.75,-0.25; 10 -5.75,-0.75; 11 -5.75,-1.25; 12 -5.75,-1.75; 13 -5.75,-2.25; 14 -5.75,-2.75; 15 -5.75,-3.25; 16 -5.75,-3.75; 33 5.75,-3.75; 34 5.75,-3.25; 35 5.75,-2.75; 36 5.75,-2.25; 37 5.75,-1.75; 38 5.75,-1.25; 39 5.75,-0.75; 40 5.75,-0.25; 41 5.75,0.25; 42 5.75,0.75; 43 5.75,1.25; 44 5.75,1.75; 45 5.75,2.25; 46 5.75,2.75; 47 5.75,3.25; 48 5.75,3.75 | smd 0.305 x 1.194: 17 -3.75,-5.75; 18 -3.25,-5.75; 19 -2.75,-5.75; 20 -2.25,-5.75; 21 -1.75,-5.75; 22 -1.25,-5.75; 23 -0.75,-5.75; 24 -0.25,-5.75; 25 0.25,-5.75; 26 0.75,-5.75; 27 1.25,-5.75; 28 1.75,-5.75; 29 2.25,-5.75; 30 2.75,-5.75; 31 3.25,-5.75; 32 3.75,-5.75; 49 3.75,5.75; 50 3.25,5.75; 51 2.75,5.75; 52 2.25,5.75; 53 1.75,5.75; 54 1.25,5.75; 55 0.75,5.75; 56 0.25,5.75; 57 -0.25,5.75; 58 -0.75,5.75; 59 -1.25,5.75; 60 -1.75,5.75; 61 -2.25,5.75; 62 -2.75,5.75; 63 -3.25,5.75; 64 -3.75,5.75
SOT95P280X145-5N = smd 1.27 x 0.559: 1 -1.295,0.94; 2 -1.295,0; 3 -1.295,-0.94; 4 1.295,-0.94; 5 1.295,0.94
VREG_V62/16624-01YE = smd 0.6 x 0.24: 1 -1.4,1; 2 -1.4,0.5; 3 -1.4,0; 4 -1.4,-0.5; 5 -1.4,-1; 6 1.4,-1; 7 1.4,-0.5; 8 1.4,0; 9 1.4,0.5; 10 1.4,1 | smd 1.65 x 2.4: 11 0,0
IFD95 = drill 0.8 square: GND 1.905,5.08; OUT 0,5.08; V+ -1.905,5.08 | hole 1.6: -2.54,7.62; 2.54,7.62 | hole 3.3: 0,0
GCT_USB4105-GF-A = smd 0.6 x 1.15: A1_B12 -3.2,4.755; A4_B9 -2.4,4.755; B1_A12 3.2,4.755; B4_A9 2.4,4.755 | smd 0.3 x 1.15: A5 -1.25,4.755; A6 -0.25,4.755; A7 0.25,4.755; A8 1.25,4.755; B5 1.75,4.755; B6 0.75,4.755; B7 -0.75,4.755; B8 -1.75,4.755 | drill 0.6 pad 1.1 long: SH1 -4.32,4.18; SH2 4.32,4.18 | drill 0.6 pad 1 long: SH3 -4.32,0; SH4 4.32,0 | hole 0.65: 2.89,3.68; -2.89,3.68
GCT_MEM2051-00-195-00-A_REVD1 = smd 1 x 0.95: CD -3.56,7.425 | smd 0.8 x 1.5: P1 1.94,-3.66; P2 0.84,-3.26; P3 -0.26,-3.66; P4 -1.36,-3.86; P5 -2.46,-3.66; P6 -3.56,-3.86; P7 -4.66,-3.66; P8 -5.76,-3.66 | smd 1.3 x 1.4: S1 -4.95,7.2; S2 0.75,7.2 | smd 1.4 x 1.9: S3 6.6,-6.95; S4 -6.55,-5.95
R0402 = smd 0.6 x 0.7: 1 -0.5,0; 2 0.5,0
IND_LQH3NPN2R2MJRL = smd 0.8 x 2.7: 1 -1.1,0; 2 1.1,0
JST_B8B-PH_HEADER = drill 0.8 long: P1 7,0.048; P2 5,0.048; P3 3,0.048; P4 1,0.048; P5 -1,0.048; P6 -3,0.048; P7 -5,0.048; P8 -7,0.048
1X03' = drill 1.016: 1 -2.54,0; 2 0,0; 3 2.54,0
VISHAY_SIS468DN-T1-GE3 = smd 0.99 x 0.405: 1 -1.435,0.99; 2 -1.435,0.33; 3 -1.435,-0.33; 4 -1.435,-0.99 | smd 0.76 x 0.405: 5 1.55,-0.99; 6 1.55,-0.33; 7 1.55,0.33; 8 1.55,0.99 | smd 1.725 x 2.235: 9 0.557,0
TO92 = drill 0.813 octagon: 1 1.27,0; 2 0,1.905; 3 -1.27,0
R0805 = smd 1.3 x 1.5: 1 -0.95,0; 2 0.95,0
B3F-10XX = drill 1.016 long: 1 -3.251,2.261; 2 3.251,2.261; 3 -3.251,-2.261; 4 3.251,-2.261
SOT23-BEC = smd 1 x 1.4: B -0.95,-1.1; C 0,1.1; E 0.95,-1.1
IF-E96E = drill 0.65: GND 1.27,1.27 | drill 0.65 square: SIG -1.27,1.27 | hole 1.524: 2.54,3.81; -2.54,3.81 | hole 3.302: 0,-3.81
SMD4-2.54-4.6X6.5MM = smd 1.4 x 1.6: 1 -1.27,-4.68; 2 1.27,-4.68; 3 1.27,4.68; 4 -1.27,4.68
HC49/S = drill 0.813: 1 -2.413,0; 2 2.413,0

### Placement (x,y rotation side)
3V3  28,12 0 top
3V3_EN  28.3,18 0 top
5V  13.5,12 0 top
5V_EN  16.1,19.7 0 top
BAT  56,3.5 180 top
BOOT0  74,44 180 top
C100  93,32.55 270 bottom
C101  49.7,42.2 180 bottom
C102  44.4,42.2 0 bottom
C103  8.5,38 90 top
C104  27.5,36 270 bottom
C105  21.5,36 270 bottom
C106  17.5,36 270 bottom
C107  25,66.5 270 bottom
C108  29,70 180 bottom
C109  56,66.5 270 bottom
C110  60,70 180 bottom
C111  59.9,36.8 270 top
C200  46,4.5 90 bottom
C201  59,12.5 90 top
C202  57.5,12.5 90 top
C203  69.8,10 0 top
C204  69.8,11.5 0 top
C205  33.55,3.2 0 top
C206  33.5,5 0 top
C207  37,9 90 top
C208  33,11 0 top
C209  33,12.5 0 top
C210  33,14.5 0 top
C211  33,16.5 0 top
C212  18.5,3.3 0 top
C213  18.5,5 0 top
C214  22.5,9 90 top
C215  18.5,11 0 top
C216  18.5,12.5 0 top
C217  18.5,14.5 0 top
C218  18.5,16.5 0 top
C219  63.9,19.7 180 bottom
C220  37.5,36.75 90 top
C221  35.6,36.75 90 top
C222  51.3,25.35 270 top
C223  53.3,25.35 270 top
C224  54,35.75 270 top
C225  55.5,35.75 270 top
C226  38.3,27.85 90 top
C227  36.3,27.85 90 top
C228  37.4,30.2 180 top
C229  40.3,40.8 90 top
C230  62.4,10 180 top
C231  52.4,38.9 0 top
CHRGING  48,3.5 0 top
CN1  78,-0.1 0 top
D1  47.5,16 270 bottom
D100  65.95,11.5 90 top
FB200  37.5,40.8 90 top
GND  54,49 0 top
H1  5,68 90 top
H2  91,68 90 top
H3  5,5 90 top
H4  91,5 90 top
HEART  28.5,22.5 90 top
I2C  67,22 180 top
IC1  45.7,32.5 270 top
IC2  57.5,8.5 90 top
IC4  33.5,8 0 top
IC5  19,8 0 top
IF1  29,63 0 top
IF2  60,63 0 top
J1  66,2.6 0 top
J2  87,35 90 top
J200  51,11 270 top
L1  28.5,8 90 top
L2  14,8 90 top
LED1  22.5,68.5 0 top
LED2  53.5,68 0 top
LED3  72.5,68 0 top
MIDI  40,15.5 270 top
OH_SHIT  83.8,24.8 180 top
OLED  5,32 270 top
POTS  22.5,39 180 top
PWR_SW  [1X03']  43.5,7.5 90 top
Q1  49,8.1 180 top
Q2  77,18.5 0 top
Q3  82.6,18.5 0 top
R100  42.2,19 180 top
R101  51.5,16 270 bottom
R102  65,4 90 bottom
R103  67.5,4 90 bottom
R104  49,23 270 top
R105  47,23 270 top
R106  89.3,33.3 270 bottom
R107  93.2,39 90 bottom
R108  88,39 90 bottom
R109  78,25.2 90 top
R110  89,24.7 270 top
R111  76.6,31.4 180 top
R112  31,28 270 top
R113  33.5,28 90 top
R114  92.6,21.9 90 top
R115  32.5,22.5 0 top
R116  58.3,36.8 270 top
R117  10,18 270 top
R118  59,41 0 bottom
R119  59,39.5 0 bottom
R120  65,40.5 270 bottom
R121  27,52.5 270 top
R122  31.5,57 90 top
R123  27,57.1 90 top
R124  58.9,54.2 180 top
R125  59.7,57.9 90 top
R126  64.1,58.8 90 top
R127  14,52.5 0 top
R128  14,54.5 0 top
R129  10,59.5 0 top
R130  22.5,64.5 270 top
R131  12,48.5 180 top
R132  20,47.5 180 top
R133  21,52.5 0 top
R134  21,54.5 180 top
R135  46.5,54 0 top
R136  50,54 180 top
R137  38.5,57.5 90 top
R138  53.5,64 270 top
R139  41.5,57.5 90 top
R140  42.5,54 180 top
R141  35.5,52.1 270 top
R142  42.5,51.5 180 top
R143  73,54.5 180 top
R144  72,57.5 270 top
R145  71.5,61 0 top
R146  72.5,64.5 270 top
R147  84,54 0 top
R148  80.5,54 0 top
R149  35.5,65 270 top
R150  65.5,64.5 270 top
R151  88,19 0 top
R200  53.5,7.5 180 top
R201  37,5.5 270 top
R202  30,12 90 top
R203  22.5,5.5 270 top
R204  15.5,12 90 top
R205  53.5,9.5 0 top
R206  51,3.5 270 top
R207  67,17.5 270 top
R208  69,17.5 270 top
RELAY_CTL  [1X03']  88.8,14.6 180 top
ROTARY  62,44 180 top
RST  65.8,35.4 180 top
RX1  35.5,68.5 0 top
RX2  65.5,68.5 0 top
SPEAKER1  7,48.5 0 top
SPEAKER2  36.5,48.5 0 top
SPKR_EN  6,17.5 270 top
SWD  [1X03']  66.1,27.1 0 top
T1  63.1,54.4 180 top
T2  30.5,52.5 180 top
T3  15,57.5 270 top
T4  19.5,57.5 90 top
T5  50,57.5 90 top
T6  45,57.5 270 top
T7  81,57.5 90 top
T8  76,57.5 270 top
T9  16,48.5 90 top
T10  38.5,53 90 top
TX1  16,67 0 top
TX2  47,67 0 top
TX3  78,67 0 top
U2  49.5,16 270 top
XTAL  47.5,44 180 top

### Tracks (layer width: path | path; a pad name or v marks a point on that pad's centre or on a via)
3V3_BUCK  (via drill 0.25)
  Top 0.152: IC4.10 35.4,9 v35.8,8.6
  Bottom 0.152: v35.8,8.6 35,9.4 31.7,9.4 v31.3,9.8
  pour Top (no thermals): 32.4,8.95 32.4,10.1 32.8,10.5 32.8,19.4 31,19.4 31,9.7 31.75,8.95
  pour Top (no thermals): 28.4,19.5 32.8,19.5 32.8,14 30.3,14 28.4,15.9
5V_BUCK  (via drill 0.25)
  Top 0.152: IC5.10 21.1,9 v21.4,8.7
  Bottom 0.152: v21.4,8.7 20.5,9.6 17.1,9.6 v16.8,9.9
  pour Top (no thermals): 17.25,8.95 17.9,8.95 17.9,10.1 18.3,10.5 18.3,21.4 16.5,21.4 16.5,9.7
+3V3  (via drill 0.25)
  Top 0.152: R121.2 v27,50.4 | R124.2 v56.9,54.2 | IC1.48 | R202.2 27.03,15.82 3V3_EN.1
  Top 0.203: R116.2 57.15,35.95 v57.1,35.9 56.38,36.62 C225.1 C224.1 53,36.62 52.62,36.25 IC1.64 52.65,36.25 v52.8,36.4 | C231.1 50.7,38.9 v50.3,38.5 50.05,38.25 IC1.1 | FB200.2 v37.5,42.8 | R208.2 v69,15.6 | R207.2 v67,15.6 | R114.2 v92.6,23.9 | R110.2 v89,22.6
  Top 0.254: J2.P4 91.86,33.64 v92.1,33.4 | R109.2 v78,27 | R111.2 74.3,30.05 v74.3,30
  Top 0.305: IC1.48 50.77,26.75 C222.1 C223.1 52.33,26.23 v52.3,26.25 | IC1.32 39.95,27.65 39.27,26.98 C226.1 v37.3,26.98 C227.1 | IC1.19 38.35,35.25 37.73,35.88 C220.1 37.48,35.9 v36.5,35.9 35.62,35.9 C221.1 | C103.1 5.17,37.12 OLED.P7 | R117.2 v10,16.1
  Bottom 0.152: R101.2 51.45,15.1 v50.2,15.1 | R120.2 66.15,39.65 v67,40.5
  Bottom 0.254: v92.1,33.4 92.97,33.4 C100.1 | R106.2 89.15,32.35 v88.2,31.4 | R107.2 91.75,39.95 v91.7,39.9 | R108.2 v88,41.3 | R119.2 R118.2 56.65,42.5 v56.6,42.5
  pour Route15 (rank 2, no thermals): -2.1,-0.7 -2.1,74.8 97.9,74.8 97.9,-0.7
+5V  (via drill 0.25)
  Top 0.152: R204.2 15.5,16.2 14.8,16.9 14.8,19.67 5V_EN.1
  Top 0.203: R138.2 v53.5,62.1 | R149.2 v35.5,63 | R130.2 v22.5,62.4
  Top 0.254: R129.1 v7.6,59.5 | v70.6,59.6 70.55,59.65 R145.1 70.55,62.95 71.25,63.65 R146.2 72.65,63.8 v73.8,63.8 | R150.2 v65.5,62.5
  Top 0.406: v35.23,56.57 38.48,56.57 R137.1 | v40.7,20.7 41.1,21.1 42.8,21.1 v43.3,21.6 | v44.7,20.6 44.5,20.4 41.3,20.4 40.9,20 40.4,20 40,20.4 v40,20.7
  Route15 0.406: SPEAKER2.1 v35.23,56.57
  Bottom 0.203: C219.1 63.02,21.93 I2C.P1
  Bottom 0.254: C108.1 27.09,68.97 IF1.V+ 25.7,68.08 C107.1 | C110.1 58.09,68.97 58.09,68.1 | 58.09,68.1 IF2.V+ | C109.1 56.73,68.1 58.09,68.1
  Bottom 0.406: I2C.P1 57.35,21.95 55.7,20.3 45,20.3 v44.7,20.6 44.3,20.6 v43.3,21.6 | v40.7,20.7 v40,20.7 39.2,20.7 37.6,19.1 34.4,19.1 33.2,20.3 22.5,20.3 20,22.8 15.9,22.8 14.83,21.73 5V_EN.1
  pour Route15 (no thermals): 18.3,17.5 13.6,17.5 10.8,20.3 10.8,38.5 0.3,49 0.3,72.8 95.7,72.8 95.7,55.7 15.9,55.7 11.6,51.4 11.6,43.3 14,40.9 14,24.2 18.3,19.9
ADC_IN8
  Top 0.203: R112.1 R113.2 33.5,30.1 35.15,31.75 IC1.26
ADC_IN11
  Top 0.152: POTS.P7 27.5,41.8 29.5,43.8 42.1,43.8 45.45,40.45 IC1.9
  Bottom 0.152: C104.1 POTS.P7
ADC_IN12
  Top 0.152: IC1.10 44.95,37.25 45.3,36.9 45.3,36.3 44.8,35.8 42.4,35.8 41.5,36.7 40.9,36.7 39.9,37.7 39.3,37.7 38.5,38.5 33.2,38.5 31.1,36.4 18.2,36.4 17.5,37.1 POTS.P2
  Bottom 0.152: C106.1 POTS.P2
ADC_IN13
  Top 0.152: IC1.11 44.45,36.65 44.1,36.3 43.2,36.3 42.3,37.2 41.3,37.2 40.4,38.1 39.7,38.1 38.7,39.1 32.9,39.1 30.9,37.1 21.8,37.1 21.5,37.4 POTS.P4
  Bottom 0.152: C105.1 POTS.P4
BOOT0_CONN
  Top 0.152: IC1.60 52.55,34.25 52.9,33.9 58.6,33.9 59.8,35.1 60.7,35.1 61.9,36.3 71,36.3 74,39.3 BOOT0.2
BUCK33_LOGIC
  Top 0.152: IC4.6 IC4.7 IC4.8 36.88,8 C207.1 R201.1
BUCK50_LOGIC
  Top 0.152: IC5.6 IC5.7 IC5.8 22.38,8 C214.1 R203.1
CC1  (via drill 0.25)
  Top 0.152: v64.8,5.9 64.75,5.95 J1.A5
  Bottom 0.152: R102.2 65,5.7 v64.8,5.9
CC2  (via drill 0.25)
  Top 0.152: v67.8,6 67.75,6.05 J1.B5
  Bottom 0.152: R103.2 67.5,5.7 v67.8,6
CHG_PROG
  Top 0.203: R205.2 54.65,9.79 IC2.5
CHRG_STAT  (via drill 0.25)
  Top 0.203: IC2.1 v55.6,7.21 v55.6,7.2 | v53.3,2.6 51.05,2.6 R206.2
  Bottom 0.203: v55.6,7.2 55.6,5.75 53.3,3.45 v53.3,2.6
COIL1_B
  Top 0.203: R128.1 11.5,56.15 11.5,57.3 12.65,58.45 T3.B
COIL1_NEG
  Top 0.254: T3.C 18.2,57.5 | 18.2,57.5 T4.C 18.4,67.14 | 18.4,67.14 TX1.GND | LED1.C 20.81,69.55 18.4,67.14 | T9.E 17.1,55.5 18.2,56.6 18.2,57.5
COIL1_POS
  Top 0.254: R129.2 10.95,62.45 14.73,66.23 TX1.SIG
COIL2_B
  Top 0.254: R136.1 50.85,56.3 T5.B
COIL2_NEG  (via drill 0.25)
  Top 0.254: T6.C T5.C | T5.C 48.9,61 49.5,61.6 49.5,64.8 48.27,66.03 TX2.GND 49.05,69.05 LED2.C | T10.E 39.6,54.9 v39.8,55.1 | v48.4,56.3 48.9,56.8 T5.C
  Bottom 0.254: v39.8,55.1 40.2,55.5 47.6,55.5 v48.4,56.3
COIL2_POS
  Top 0.254: R137.2 38.5,61.04 TX2.SIG
COIL3_B
  Top 0.152: R144.1 74.8,58.35 T8.B
COIL3_NEG
  Top 0.254: T8.C T7.C 80.2,57.8 80.2,67.34 TX3.GND 79.27,68.53 78.1,69.7 76.4,69.7 76.1,69.4 72.85,69.4 LED3.C
COIL3_POS
  Top 0.254: R145.2 76.73,65.28 TX3.SIG
COIL12_B
  Top 0.203: R134.2 20.15,56.1 T4.B
COIL22_B
  Top 0.254: R139.2 41.6,58.45 T6.B
COIL32_B
  Top 0.152: R147.2 84.85,55.35 83.65,56.55 T7.B
GND  (via drill 0.25)
  Top 0.152: IC5.3 IC5.11 | IC4.3 IC4.11 | IC4.9 34.2,8.5 | IC5.9 19.7,8.5 | C214.2 22.48,9.9 v21.5,9.9 | C207.2 35.92,9.88 v35.9,9.9 | 5V.C v13.5,13.8 | 3V3.C v28,13.6 | v56.9,14.3 56.9,13.97 C202.2 57.9,13.78 v57.9,14.3 | v59.6,14.3 59.6,13.97 C201.2 58.7,13.68 v58.7,14.3 | v55.6,14.8 54.25,14.8 U2.3 54.18,13.52 v54.2,13.5 | C229.2 41.42,41.67 v41.5,41.6 | v43.9,40.2 43.95,40.15 IC1.12 43.95,37.15 v43.8,37 | T2.E v28.5,53.6 | T2.E 29.5,53.65 v29.5,54.9 | T2.E 29.55,53.75 v30.5,54.7 | R133.1 20.15,51.35 v20.1,51.3 | R127.1 13.15,51.45 v12.8,51.1 | T3.E 13.65,56.55 v12.8,57.4 | T3.E 12.65,56.55 v12.6,56.6 | T3.E 15.05,56.55 v15.4,56.2 | T4.E 20.6,59.6 v20.7,59.7 | T4.E 20.65,58.5 v21.9,58.5 | T4.E 20.85,58.45 v21.6,57.7 | J2.S1 v79.8,28.8 | J2.S2 79.85,35.8 v81.2,35.8 | J2.S4 94.65,28.45 v94.7,28.5 | J2.S3 v92.1,41.6 | R143.1 73.9,54.55 v73.9,55.6 73.9,55.75 74.7,56.55 T8.E | T8.E v74.9,55.6 | T8.E 76.05,56.55 v76.4,56.2
  Top 0.203: D100.2 65.95,9.15 v65.9,9.1 | v54.4,6.4 54.4,7.45 R200.1 54.35,7.65 v53.5,8.5 52.65,9.35 R205.1 | IC2.2 v57.5,8.4 | HEART.C v26.3,22.5 | R113.1 v33.5,25.9 | C111.2 60.48,36.5 v61,36.5 | v56.7,34.9 55.52,34.9 C225.2 C224.2 53.2,34.88 52.33,35.75 IC1.63 52.35,35.75 v52.8,35.3 | C231.2 54.3,38.9 v54.4,38.8
  Top 0.254: C212.2 19.35,4.97 C213.2 | C213.2 19.38,5.83 19.2,6 19.2,7 | v20.4,5.3 19.68,5.3 C213.2 | C212.2 19.85,3.8 v20.5,3.8 | C212.2 19.85,2.8 v20.5,2.8 | C213.2 19.77,4.6 v20.4,4.6 | C205.2 34.4,4.97 C206.2 | C206.2 33.7,5.67 33.7,7 | C205.2 34.9,3.7 v35.5,3.7 | C205.2 34.9,2.7 v35.5,2.7 | C206.2 34.67,5.3 v35.5,5.3 | C206.2 34.88,4.5 v35.5,4.5 | T1.E 61.75,55.9 61.75,56.75 v61.7,56.8 | T1.E 61.2,55.5 v61.1,55.6 | T1.E 62.5,55.85 v62.5,56.8 | T7.E v82.1,59.6 | T7.E 83.45,58.45 v83.5,58.4 | T7.E 82.25,58.45 v83.3,59.5 | T6.E 43.65,56.55 v42.8,57.4 | T6.E 42.85,56.55 v42.8,56.5 | T6.E 44.25,56.2 v45.2,56.2 | T5.E 51.1,59.4 v51.2,59.5 | T5.E 52.25,58.45 v52.3,58.5 | T5.E 51.45,58.1 v53.1,58.1 | R148.1 v78.3,54 | J2.P6 90.92,31.5 v92.1,31.5 | R140.1 v44.5,54 R135.1
  Top 0.305: IC1.47 48.95,25.75 50.23,24.48 C222.2 v52.3,24.48 C223.2 | IC1.31 38.83,29.25 C226.2 v37.3,28.73 | C227.2 v37.3,28.73 | v35.8,29.8 36.2,30.2 C228.2 37.3,29.43 v37.3,28.73 | IC1.18 39.05,35.75 38.7,36.1 v38.7,36.8 38.33,36.8 C220.2 37.48,37.6 v36.6,37.6 35.62,37.6 C221.2 35.58,37.6 v34.5,37.6 | OLED.P8 8.38,39 C103.2
  Bottom 0.152: C106.2 18.07,35.7 v18.7,35.7 | C105.2 22.18,35.8 v23,35.8 | C104.2 28.18,35.8 v28.8,35.8
  Bottom 0.203: R102.1 v65,2 | R103.1 v67.5,2 | C200.2 46.4,5.78 v46.4,6.4 | C219.2 64.78,21.73 I2C.P2
  Bottom 0.254: C108.2 30.91,68.97 IF1.GND | C110.2 61.91,68.97 IF2.GND | C102.2 43.75,43.35 v43.7,43.4 | C101.2 50.35,42.45 v51.1,43.2 | C107.2 26.02,65.62 v27,66.6 | C109.2 57.12,65.62 v58,66.5 | v92.1,31.5 92.28,31.68 C100.2
  other vias: 59.8,5.2 59.8,6 59.8,6.8 60.6,5.2 60.6,6 60.6,6.8 72.1,5.2 71.3,5.2 72.1,6 71.4,6 72.1,6.8 72.1,7.6 70.7,9.1 70.7,10.7 71.5,11.5 71.6,10 69.8,8.4 61.6,8.7 59.8,10.2 60.6,10 33.5,7.2 33.5,8.8 33.5,8 19,7.9 19,8.9 19,7.1 20.7,11 20.7,12.5 20.7,14.5 20.7,16.5 20.6,15.5 20.7,13.5 20.3,10.2 35,11 35.2,12.5 35.2,14.5 35.2,16.5 35,15.5 35,13.5 71.6,27.3 64.8,35.4 42.3,24.1 46.3,29.2 42.4,48.1 46.2,49.5 13.8,51.1 17.4,24 28.3,50.7 86.4,33.6 82.1,33.5 86.4,31.4 72.4,32.6 86.3,35.1 86.6,37.5 71.3,52.2 72,34.5 78.1,33 88.1,28.6 91.7,26.7 75.4,24.7 41.4,31.1 54.7,21.9 48.3,52.3 48.4,34 43.6,25.3 23.6,53.4 41.4,34.5 10,1 11,3 11,5 11,7 10,9 9,10 8,11 6,11 4,11 1,11 1,13 1,15 1,17 1,19 1,21 1,23 1,25 1,27 1,29 1,31 1,33 1,35 1,37 1,39 1,41 1,43 1,45 1,47 1,49 1,51 1,53 1,55 1,57 1,59 1,61 2,62 4,62 6,62 8,63 10,64 11,65 11,67 11,69 10,71 11,72 15,72 17,72 20,72 12,72 22,72 24,72 26,72 28,72 30,72 33,72 35,72 37,72 39,72 41,72 43,72 46,72 48,72 51,72 53,72 55,72 56,72 59,72 61,72 64,72 66,72 68,72 70,72 72,72 74,72 77,72 79,72 82,72 84,72 86,72 85,70 85,68 85,66 86,64 88,62 90,61 92,61 94,61 95,60 95,58 95,56 95,54 95,52 95,48 95,46 95,44 95,43 95,40 95,38 95,36 95,34 95,32 95,30 95,26 95,24 95,22 95,20 95,18 95,16 95,14 95,12 93,11 91,11 89,11 87,10 86,8 85,6 85,4 86,2 84,1 82,1 80,1 78,1 76,1 74,1 71,1 69,1 67,1 65,1 63,1 61,1 59,1 57,1 55,1 53,1 51,1 50,1 46,1 44,1 42,1 40,1 38,1 36,1 34,1 32,1 30,1 28,1 26,1 24,1 22,1 20,1 18,1 16,1 14,1 12,1 23.7,26 23.7,27.9 23.7,30 23.7,32 23.7,34 26,46.7 24.9,48.3 27.8,48.4 31.3,48.2 59.5,50.3 57.7,51.7 62.1,50 66.5,52 74,49.8 76.6,52 65.5,61.3 68.3,59.7 57.1,19.9
  pour Route2: -0.2,-0.5 -0.2,73.5 96.5,73.5 96.5,-0.5
  pour Top (no thermals): 63,4.9 63,8.8 62.2,9.6 62.2,10.6 59.5,10.6 59.5,4.9
  pour Top (no thermals): 69,4.9 69,8.3 69.8,9.1 69.8,12.2 72.3,12.2 72.3,4.9
  pour Top (no thermals): 18.8,2.7 18.8,6 18.3,6.5 18.3,9.9 18.7,10.3 18.7,17.6 23.4,17.6 23.4,9.5 23.2,9.3 21.4,9.3 21.1,9.6 19.9,9.6 19.8,9.5 19.8,6.7 21.2,5.3 21.2,2.5 19,2.5
  pour Top (no thermals): 33.8,2.6 33.8,5.5 32.8,6.5 32.8,10 33.2,10.4 33.2,17.3 37.5,17.3 37.7,17.1 37.7,9.6 37.4,9.3 35.8,9.3 35.5,9.6 34.3,9.6 34.3,6.7 35.7,5.3 35.7,2.6
  pour Top (rank 3): -1.1,-0.3 -1.1,73.9 97,73.9 97,-0.3
  pour Bottom (rank 4): -2.6,-0.7 -2.6,75.6 97.7,75.6 97.7,-1 -2.4,-1 -2.6,-1
I2C_SCL  (via drill 0.25)
  Top 0.152: I2C.P3 R207.1 59.95,18.35 55.6,22.7 v54.7,22.7 | v41.4,30.2 40,30.2 IC1.29
  Bottom 0.152: v54.7,22.7 42.2,22.7 40.7,24.2 40.7,27.1 41.4,27.8 v41.4,30.2
I2C_SDA  (via drill 0.25)
  Top 0.152: IC1.55 52.45,31.75 53.2,32.5 58.8,32.5 60.5,34.2 65,34.2 v65.7,33.5 | v70.9,27.9 70.9,25.7 69,23.8 I2C.P4 R208.1
  Bottom 0.152: v70.9,27.9 70.9,28.3 v65.7,33.5
IC4L1
  pour Top (no thermals): 32.4,7.6 31.7,7.6 31.5,7.8 27.1,7.8 27.1,6.5 30.7,6.5 31.5,7.3 31.6,7.4 31.8,7.4 32.4,7.4
IC4L2
  pour Top (no thermals): 32.4,8.6 31.6,8.6 30.7,9.5 27.1,9.5 27.1,8.2 31.5,8.2 31.7,8.4 32.4,8.4
IC5L1
  pour Top (no thermals): 17.9,7.6 17.2,7.6 17,7.8 12.6,7.8 12.6,6.5 16.1,6.5 17,7.4 17.9,7.4
IC5L2
  pour Top (no thermals): 12.6,9.5 16.1,9.5 17,8.6 17.9,8.6 17.9,8.4 17.2,8.4 17,8.2 12.6,8.2
IF1-OUT
  Top 0.152: IF1.OUT 29,66.9 31.8,64.1 31.8,58.25 R122.2 R123.2
IF2-OUT
  Top 0.254: R126.2 64.1,59.8 | 64.1,59.8 64.1,62.4 60,66.5 IF2.OUT | R125.2 60.75,59.8 64.1,59.8
LED_HEARTBEAT
  Top 0.203: R115.2 39.7,22.5 42.45,25.25 IC1.34
LTV+  (via drill 0.25)
  Top 0.152: R100.1 44.55,19 44.82,18.73 44.82,17.4 | 44.82,17.4 U2.1 | v46,18.4 45,17.4 44.82,17.4
  Bottom 0.152: D1.C 46.55,17.85 v46,18.4
LTV-  (via drill 0.25)
  Top 0.152: MIDI.2 44.32,14.23 U2.2 46.27,14.73 v46.3,14.7
  Bottom 0.152: D1.A 46.85,14.15 v46.3,14.7
MID_RX_IN
  Top 0.152: MIDI.1 40,17.65 R100.2
N$1
  Top 0.152: 3V3.A 29.9,11.25 R202.1
N$2
  Top 0.254: LED1.A R130.1
N$3
  Top 0.152: R122.1 31.5,53.65 T2.B
N$4
  Top 0.254: R146.1 LED3.A
N$5
  Top 0.254: LED2.A R138.1
N$6
  Top 0.152: R204.1 15.4,11.25 5V.A
N$7
  Top 0.152: RX1.A R149.1
N$8
  Top 0.254: RX2.A R150.1
N$9
  Top 0.152: T1.B 64.05,57.8 R126.1
N$10
  Top 0.254: R131.1 T9.C
N$17
  Top 0.203: R206.1 50.1,5.25 CHRGING.C
N$21
  Top 0.254: R141.1 37.35,52.95 T10.C
NRST
  Top 0.152: IC1.7 46.45,37.35 46.7,37.1 50.1,37.1 50.65,37.65 R116.1 59.88,37.65 C111.1 62.53,37.67 RST.4 RST.3
OH_SHIT_BTN  (via drill 0.25)
  Top 0.152: IC1.8 45.95,36.35 v46.2,36.1 | v45.3,29.6 45.6,29.9 47.1,29.9 48.6,28.4 50.1,28.4 50.6,27.9 55.1,27.9 57.1,25.9 64.1,25.9 64.8,26.6 64.8,27.7 65.9,28.8 72.3,28.8 73.7,27.4 73.7,22.8 74.4,22.1 84.4,22.1 85.07,22.77 85.07,24.7 | 85.07,24.7 OH_SHIT.1 | R114.1 89.25,21.05 87.4,22.9 87.4,24.3 87,24.7 85.07,24.7
  Bottom 0.152: v46.2,36.1 46.2,30.5 v45.3,29.6
OLED_CS
  Top 0.152: IC1.20 7.85,34.75 7.6,35 OLED.P6
OLED_DC
  Top 0.152: IC1.25 34.55,32.25 32.7,30.4 30,30.4 24.6,25 OLED.P1
OLED_RST
  Top 0.152: IC1.24 34.15,32.75 32.4,31 29.8,31 25.8,27 OLED.P2
PMOS_G
  Top 0.203: R200.2 51.9,8.25 51.9,8.6 51.41,9.09 Q1.4 50.44,9.94 J200.2
PWR_IN
  pour Top (no thermals): 40.9,8.5 43.9,8.5 44.4,8 44.4,7.3 43.7,6.6 42.1,6.6 40.4,4.9 40.4,2.4 38.2,0.2 16.5,0.2 16,0.7 16,5.8 17.25,7.05 17.9,7.05 17.9,6 18.3,5.6 18.3,2.5 18.8,2 21.6,2 21.6,5.3 31.2,5.3 31.6,5.7 31.6,6.8 31.85,7.05 32.4,7.05 32.4,6 32.8,5.6 33.1,5.6 33.2,5.5 33.2,4 33.3,3.9 33.3,2.4 33.6,2.1 36.1,2.1 36.1,5.3 37.7,5.3
R-HB
  Top 0.203: R115.1 HEART.A
RELAY  (via drill 0.3)
  Top 0.203: IC1.36 43.45,28.65 v43.5,28.7 | v72.4,26.5 72.4,22.9 73.8,21.5 87.6,21.5 88.85,20.25 R151.2
  Bottom 0.203: v43.5,28.7 44.2,28.7 45.5,27.4 59.8,27.4 61.4,29 68.7,29 71.2,26.5 v72.4,26.5
RELAY_OUT
  Top 0.305: Q2.1 79.77,17 82.37,17 Q3.1 85.27,17.1 87.8,17.1 88.8,16.1 RELAY_CTL.2
RLY_BASE
  Top 0.203: R151.1 85.9,19 84.5,20.41 Q3.2 Q2.2
ROT_CLK
  Top 0.152: ROTARY.P4 64,42.2 61.7,39.9 49.9,39.9 48.95,38.95 IC1.2
  Bottom 0.152: R120.1 64,42.35 ROTARY.P4
ROT_DAT
  Top 0.152: IC1.3 48.45,39.25 49.7,40.5 60.5,40.5 62,42 ROTARY.P3
  Bottom 0.152: R119.1 62,41.65 ROTARY.P3
ROT_SW
  Top 0.152: IC1.4 47.95,39.55 49.6,41.2 59,41.2 60,42.2 ROTARY.P2
  Bottom 0.152: R118.1 59.85,43.8 ROTARY.P2
SDIO_CK  (via drill 0.25)
  Top 0.152: IC1.53 53.05,30.75 53.4,31.1 71.1,31.1 v71.9,31.9 | v86.4,32.4 90.52,32.4 J2.P5
  Bottom 0.152: v71.9,31.9 85.9,31.9 v86.4,32.4
SDIO_CMD  (via drill 0.25)
  Top 0.152: IC1.54 52.75,31.25 53.1,31.6 70.4,31.6 73.1,34.3 v82,34.3 | J2.P3 87.34,34.74 v86.9,34.3
  Bottom 0.152: v82,34.3 v86.9,34.3 89.25,34.3 R106.1
SDIO_D0  (via drill 0.25)
  Top 0.152: IC1.39 44.95,25.95 44.67,25.68 v44.3,25.68 | J2.P7 89.14,30.34 88.9,30.1 v88.9,27.6 88.9,25.75 R110.1
  Bottom 0.152: v44.3,25.68 44.33,25.7 78.4,25.7 80.3,27.6 v88.9,27.6
SDIO_D1  (via drill 0.25)
  Top 0.152: IC1.40 45.45,25.85 43.55,23.95 v43.2,23.95 | v91.2,26 90.66,26.54 J2.P8 | R109.1 77.55,23.8 v75.4,23.8
  Bottom 0.152: v43.2,23.95 43.35,23.8 v75.4,23.8 75.5,23.9 78.2,23.9 81.1,26.8 90.4,26.8 v91.2,26
SDIO_D2  (via drill 0.25)
  Top 0.152: IC1.51 60.65,29.75 61,29.4 72.4,29.4 72.9,29.9 72.9,30.5 75.4,33 v77.2,33 | v88,36.8 88.14,36.94 J2.P1
  Bottom 0.152: v77.2,33 77.2,34.3 79.7,36.8 v88,36.8 R108.1
SDIO_D3  (via drill 0.25)
  Top 0.152: IC1.52 53.25,30.25 53.5,30.5 61.7,30.5 62,30.2 71.5,30.2 74.9,33.6 v81,33.6 | v87,35.8 87.04,35.84 J2.P2 92.64,35.84 v93.1,36.3
  Bottom 0.152: v81,33.6 81,34.4 82.4,35.8 v87,35.8 | v93.1,36.3 93.1,37.95 R107.1
SDIO_DETECT  (via drill 0.25)
  Top 0.152: IC1.35 42.95,24.75 v43,24.7 | v74.4,24.7 77.55,27.85 R111.1 77.59,31.44 J2.CD
  Bottom 0.152: v43,24.7 44.8,24.7 45.3,25.2 73.9,25.2 v74.4,24.7
SHIELD
  Top 0.152: J1.SH3 63.38,4.3 68.62,4.3 J1.SH4
  Bottom 0.152: J1.SH3 J1.SH1 | J1.SH4 J1.SH2
SPEAK1-R
  Top 0.254: SPEAKER1.2 R131.2
SPEAKER_EN  (via drill 0.25)
  Top 0.152: R132.1 31.9,47.5 33.2,46.2 41.8,46.2 v43.35,47.75 R142.1 | IC1.33 41.95,25.85 v41.5,25.4
  Bottom 0.152: v41.5,25.4 42.2,26.1 42.2,46.6 v43.35,47.75
SPI1_MISO
  Top 0.152: IC1.22 32.55,33.75 31.6,32.8 28.3,32.8 26.5,31 OLED.P4
SPI1_MOSI
  Top 0.152: IC1.23 33.75,33.25 32.1,31.6 28.6,31.6 26,29 OLED.P3
SPI1_SCK
  Top 0.152: IC1.21 31.95,34.25 31.3,33.6 28.2,33.6 27.6,33 OLED.P5
SPK2_R
  Top 0.254: R141.2 37.77,48.98 SPEAKER2.2
SPK_EN1_B
  Top 0.152: T9.B 19.1,47.55 R132.2
SPK_EN2_B
  Top 0.152: R142.2 41.1,52.05 T10.B
SPKR_EN_BTN  (via drill 0.25)
  Top 0.152: IC1.27 35.75,31.25 v34.8,30.3 | SPKR_EN.1 6.08,18.85 R117.1 11.35,18.85 15,22.5 23.4,22.5 25.7,20.2 34.6,20.2 v34.9,20.5
  Bottom 0.152: v34.8,30.3 34.9,30.2 v34.9,20.5
SWCLK
  Top 0.152: SWD.1 61.91,28.75 IC1.49
SWDIO
  Top 0.152: SWD.2 64.2,25.2 56.8,25.2 54.7,27.3 50.4,27.3 49.8,27.9 48.7,27.9 48.45,27.65 IC1.46
TIM1_CH1  (via drill 0.25)
  Top 0.203: v14.5,23.4 23.6,23.4 25.9,21.1 34,21.1 34.7,21.8 42.1,21.8 45.95,25.65 IC1.41 | v14.8,50.9 14.8,52.45 R127.2 R128.2
  Bottom 0.203: v14.5,23.4 14.5,35.3 13.7,36.1 13.7,42 14.8,43.1 v14.8,50.9
TIM2_CH1  (via drill 0.25)
  Top 0.152: IC1.50 49.85,29.25 45.4,33.7 v41.4,33.7 | v23.6,52.5 21.95,52.5 21.85,52.6
  Top 0.203: R133.2 21.85,52.6 R134.1
  Bottom 0.152: v41.4,33.7 35.8,33.7 33.5,36 33.5,41.3 23.6,51.2 v23.6,52.5
TIM3_CH1  (via drill 0.25)
  Top 0.152: IC1.56 52.25,32.25 53.1,33.1 58.5,33.1 60.1,34.7 71.2,34.7 v71.9,35.4 | v72.2,52.2 72.2,54.45 R143.2 72.15,56.5 R144.2
  Bottom 0.152: v71.9,35.4 71.9,40.6 70.1,42.4 70.1,47.3 72.2,49.4 v72.2,52.2
TIM4_CH1  (via drill 0.25)
  Top 0.152: R147.1 R148.2 81.35,52.75 79.3,50.7 61.4,50.7 54.7,44 v52.4,44 | v49.6,33.3 49.65,33.25 IC1.58
  Bottom 0.152: v52.4,44 52.4,41.4 51.4,40.4 50.2,40.4 49.2,39.4 49.2,33.7 v49.6,33.3
TIM5_CH1  (via drill 0.25)
  Top 0.152: IC1.14 42.95,39.15 42.7,39.4 41.6,39.4 v40.9,38.7 | v41.6,52.9 41.6,53.95 R140.2 41.65,56.5 R139.1
  Bottom 0.152: v40.9,38.7 40.9,52.2 v41.6,52.9
TIM10_CH1  (via drill 0.25)
  Top 0.152: IC1.61 48.45,34.75 v48.1,35.1 | v49.1,52.2 49.1,53.95 R136.2
  Top 0.254: R136.2 R135.2
  Bottom 0.152: v48.1,35.1 48.1,41.4 48,41.5 48,42.7 48.4,43.1 48.4,51.5 v49.1,52.2
UART1_RX  (via drill 0.25)
  Top 0.152: v51.5,17.9 52.13,17.27 U2.4
  Top 0.203: v51.5,17.9 50.3,19.1 47.6,19.1 45.4,21.3 45.4,24.2 46.95,25.75 IC1.43
  Bottom 0.152: R101.1 v51.5,17.9
UART2_RX  (via drill 0.25)
  Top 0.152: IC1.17 39.95,36.65 v39.6,37 | R123.1 R121.1 29,51.35 v29,51.2 29.2,51.4 T2.C 31.5,51.4 33.9,53.8 33.9,69.2 34.25,69.55 RX1.C
  Bottom 0.152: v39.6,37 39.6,37.6 29,48.2 v29,51.2
UART6_RX  (via drill 0.25)
  Top 0.152: IC1.38 44.45,27.95 45,28.5 v47,28.5 | v47.1,49.9 48.2,51 59.2,51 59.75,51.55 R124.1 | R124.1 59.75,57 R125.1 | T1.C 62,53.3 61.1,54.2 R124.1
  Top 0.254: RX2.C 66.55,69.55 67,69.1 67,55.8 64.5,53.3 T1.C
  Bottom 0.152: v47,28.5 47.1,28.6 v47.1,49.9
USB_D+
  Top 0.152: IC1.45 47.95,25.75 49,24.7 R104.1
USB_D-
  Top 0.152: IC1.44 47.45,25.55 47,25.1 R105.1
USB_VIN
  Top 0.203: IC2.4 58.44,8.76 59.1,8.1 59.1,3.5 57.35,1.75 CHRGING.A
  pour Top (no thermals): 63.4,6.9 63.4,9 62.8,9.6 62.8,10.7 62.5,11 59.3,11 59.1,10.8 59.1,9.2 58.9,9 58,9 57.8,9.2 57.8,10.5 57.6,10.7 51.5,10.7 51.2,10.4 46.8,10.4 45.3,8.9 42.6,8.9 42.1,9.4 42.1,10.8 44,12.7 63.6,12.7 64.4,11.9 65.5,11.9 65.6,12 65.6,13.4 66.3,13.4 66.3,11.1 64.4,11.1 64.2,10.9 64.2,8.7 63.9,8.4 63.9,6.9
  pour Top (no thermals): 68.6,6.8 68.6,8.5 69.4,9.3 69.4,12.1 67.9,12.1 67.7,11.9 66.2,11.9 66.2,11.1 67.5,11.1 67.6,11 67.6,8.7 68.1,8.2 68.1,6.8
  pour Top (no thermals): 68.2,12.1 68.2,13.6 71,16.4 80.4,16.4 80.4,11.7 79.6,10.9 74.2,10.9 72.4,12.7 69.6,12.7 69.4,12.5 69.4,12 68.3,12
  pour Top (no thermals): 80.2,16.4 87.6,16.4 87.6,12.6 84.3,12.6 84,12.9 80.2,12.9
USBDN_CONN
  Top 0.152: D100.1 65,9 65.25,8.75 J1.B7 65.25,6.45 65.4,6.3 66.1,6.3 66.25,6.45 J1.A7
USBDP_CONN
  Top 0.152: J1.A6 65.75,8.15 66.5,8.9 | J1.B6 66.75,8.65 66.5,8.9 | 66.5,8.9 66.5,9.1 66.9,9.5 D100.3
USBRESD_N
  Top 0.152: D100.6 65,14.3 64.1,15.2 59.4,15.2 54.5,20.1 48.3,20.1 47.84,20.55 47.84,21.36 47.05,22.15 R105.2
USBRESD_P
  Top 0.152: D100.4 66.9,14.2 65.5,15.6 59.5,15.6 54.64,20.46 48.44,20.46 48.2,20.7 48.2,21.4 48.95,22.15 R104.2
VBAT_CONN  (via drill 0.25)
  Top 0.203: R112.2 33.05,25 38.4,25 v39,24.4
  Top 0.305: IC2.3 58.44,6.04 57.9,5.5 55.6,5.5 55,4.9 BAT.1
  Bottom 0.203: v39,24.4 39,24.3 44.8,18.5 44.8,11.1 49.7,6.2 v51.7,6.2
  pour Top (no thermals): 55.7,2.7 54.2,2.7 50,6.9 50,8.6 51.1,8.6 51.1,7.5 54.2,4.4 55.7,4.4
VCAP1
  Top 0.305: IC1.30 38.73,29.75 C228.1
VLION
  Bottom 0.203: C200.1 44.84,3.62 PWR_SW.1
  pour Top (no thermals): 49.3,7 47.4,7 46.2,5.8 46.2,4.6 45.6,4 42.6,4 42.2,4.4 42.2,5.7 42.7,6.2 43.9,6.2 46,8.3 46,8.7 46.9,9.6 49.3,9.6
VREF+
  Top 0.152: IC1.13 43.45,39.65 43.17,39.92 C229.1 37.52,39.92 FB200.1
XTAL1
  Top 0.152: IC1.5 47.45,40.15 49.91,42.61 XTAL.1
  Bottom 0.254: C101.1 49.05,43.14 XTAL.1
XTAL2
  Top 0.152: IC1.6 46.95,40.15 45.09,42.01 XTAL.2
  Bottom 0.254: C102.1 45.09,42.24 XTAL.2

### Text on the board
tPlace: GND | SW | DAT | CLK | GND | GND | +3V3 | Interrupter v3 / Will Buchta / 8/2024 | GND | ADC | GND | ADC | ADC | GND | +3V3 | +3V3 | CS | SCK | MISO | MOSI | JLCJLCJLCJLC | RST | SWCLK | SWDIO | GND | DC | +5V | GND | SCL | SDA | NC | +5V | GND